# EAGLE design BpodFSM_2Plus_r1_3 (EAGLE 9.6.2)
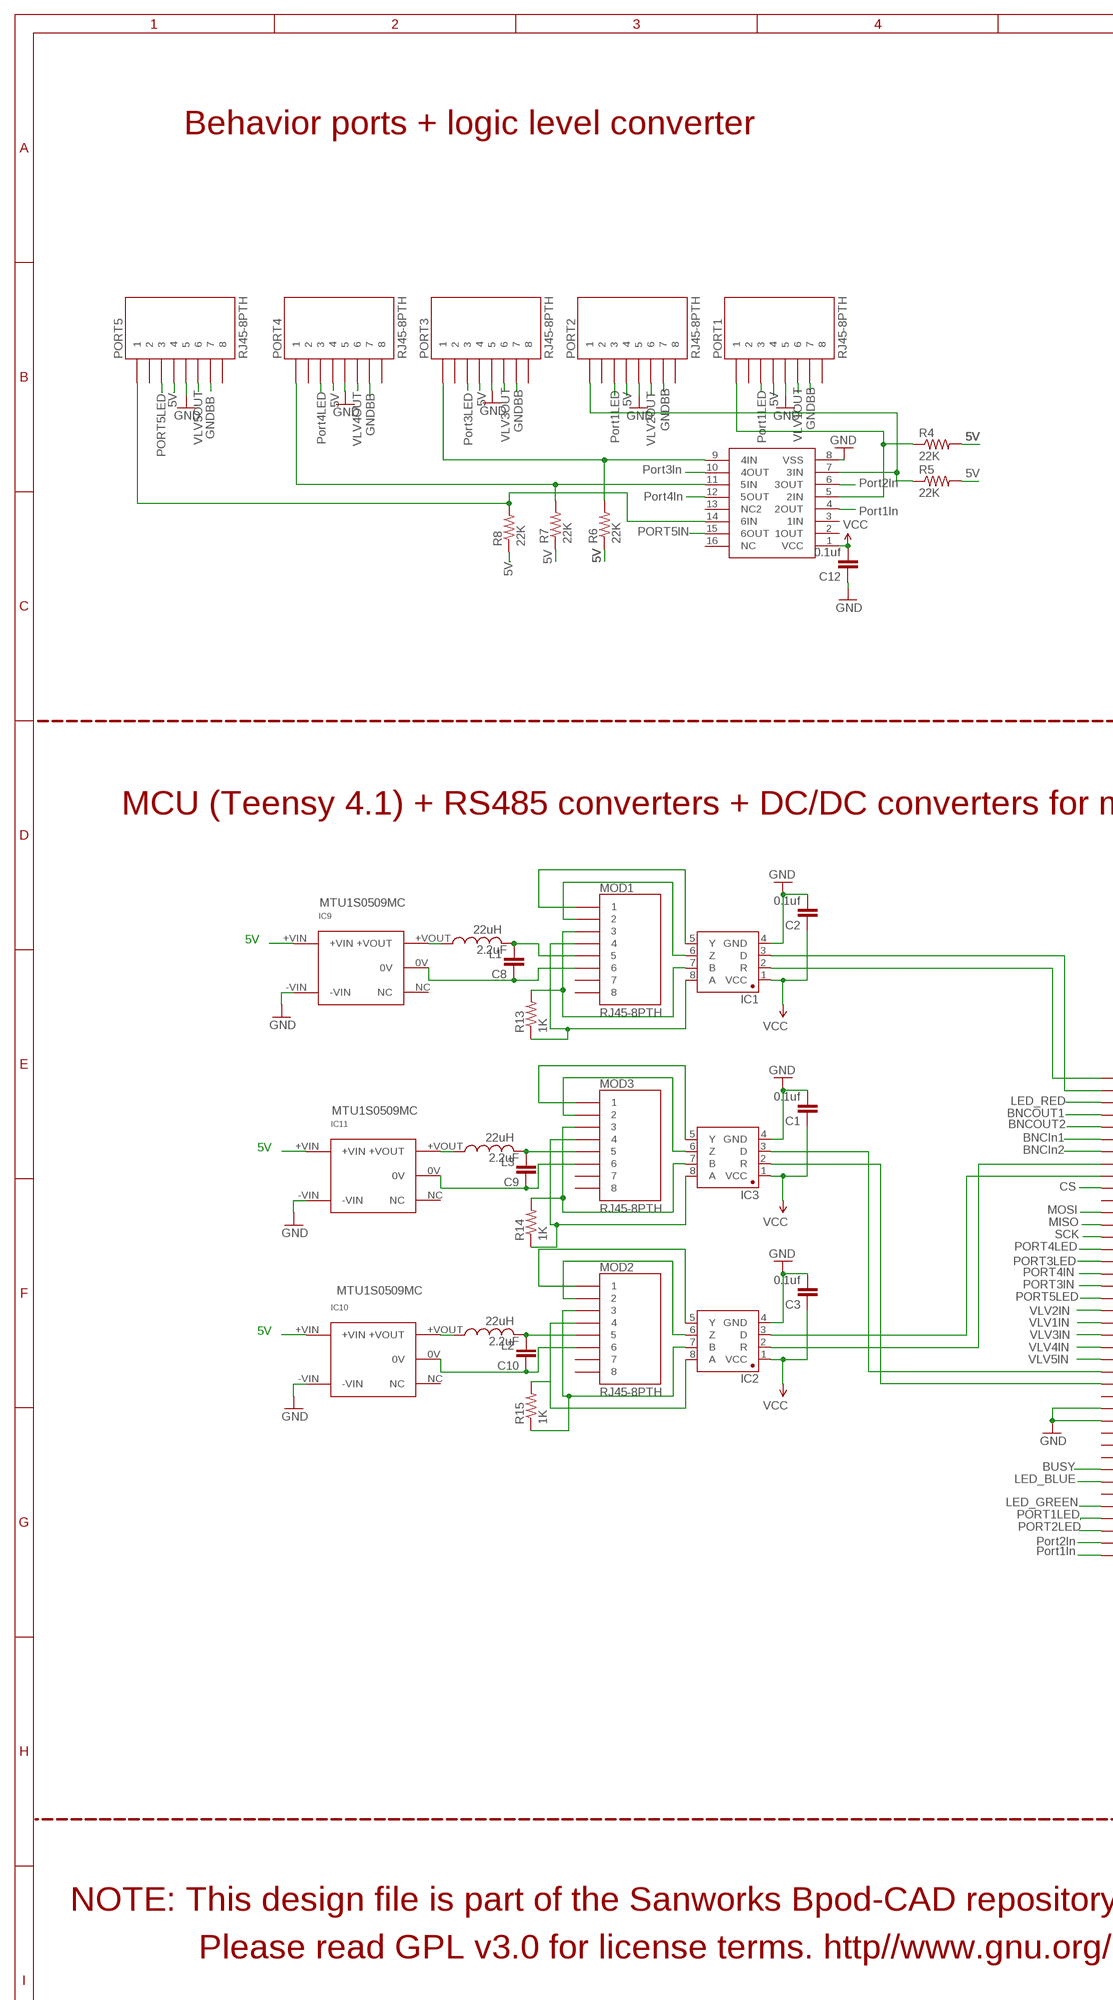
[diagram p0: schematic, sheet 1, part 1 of 2]
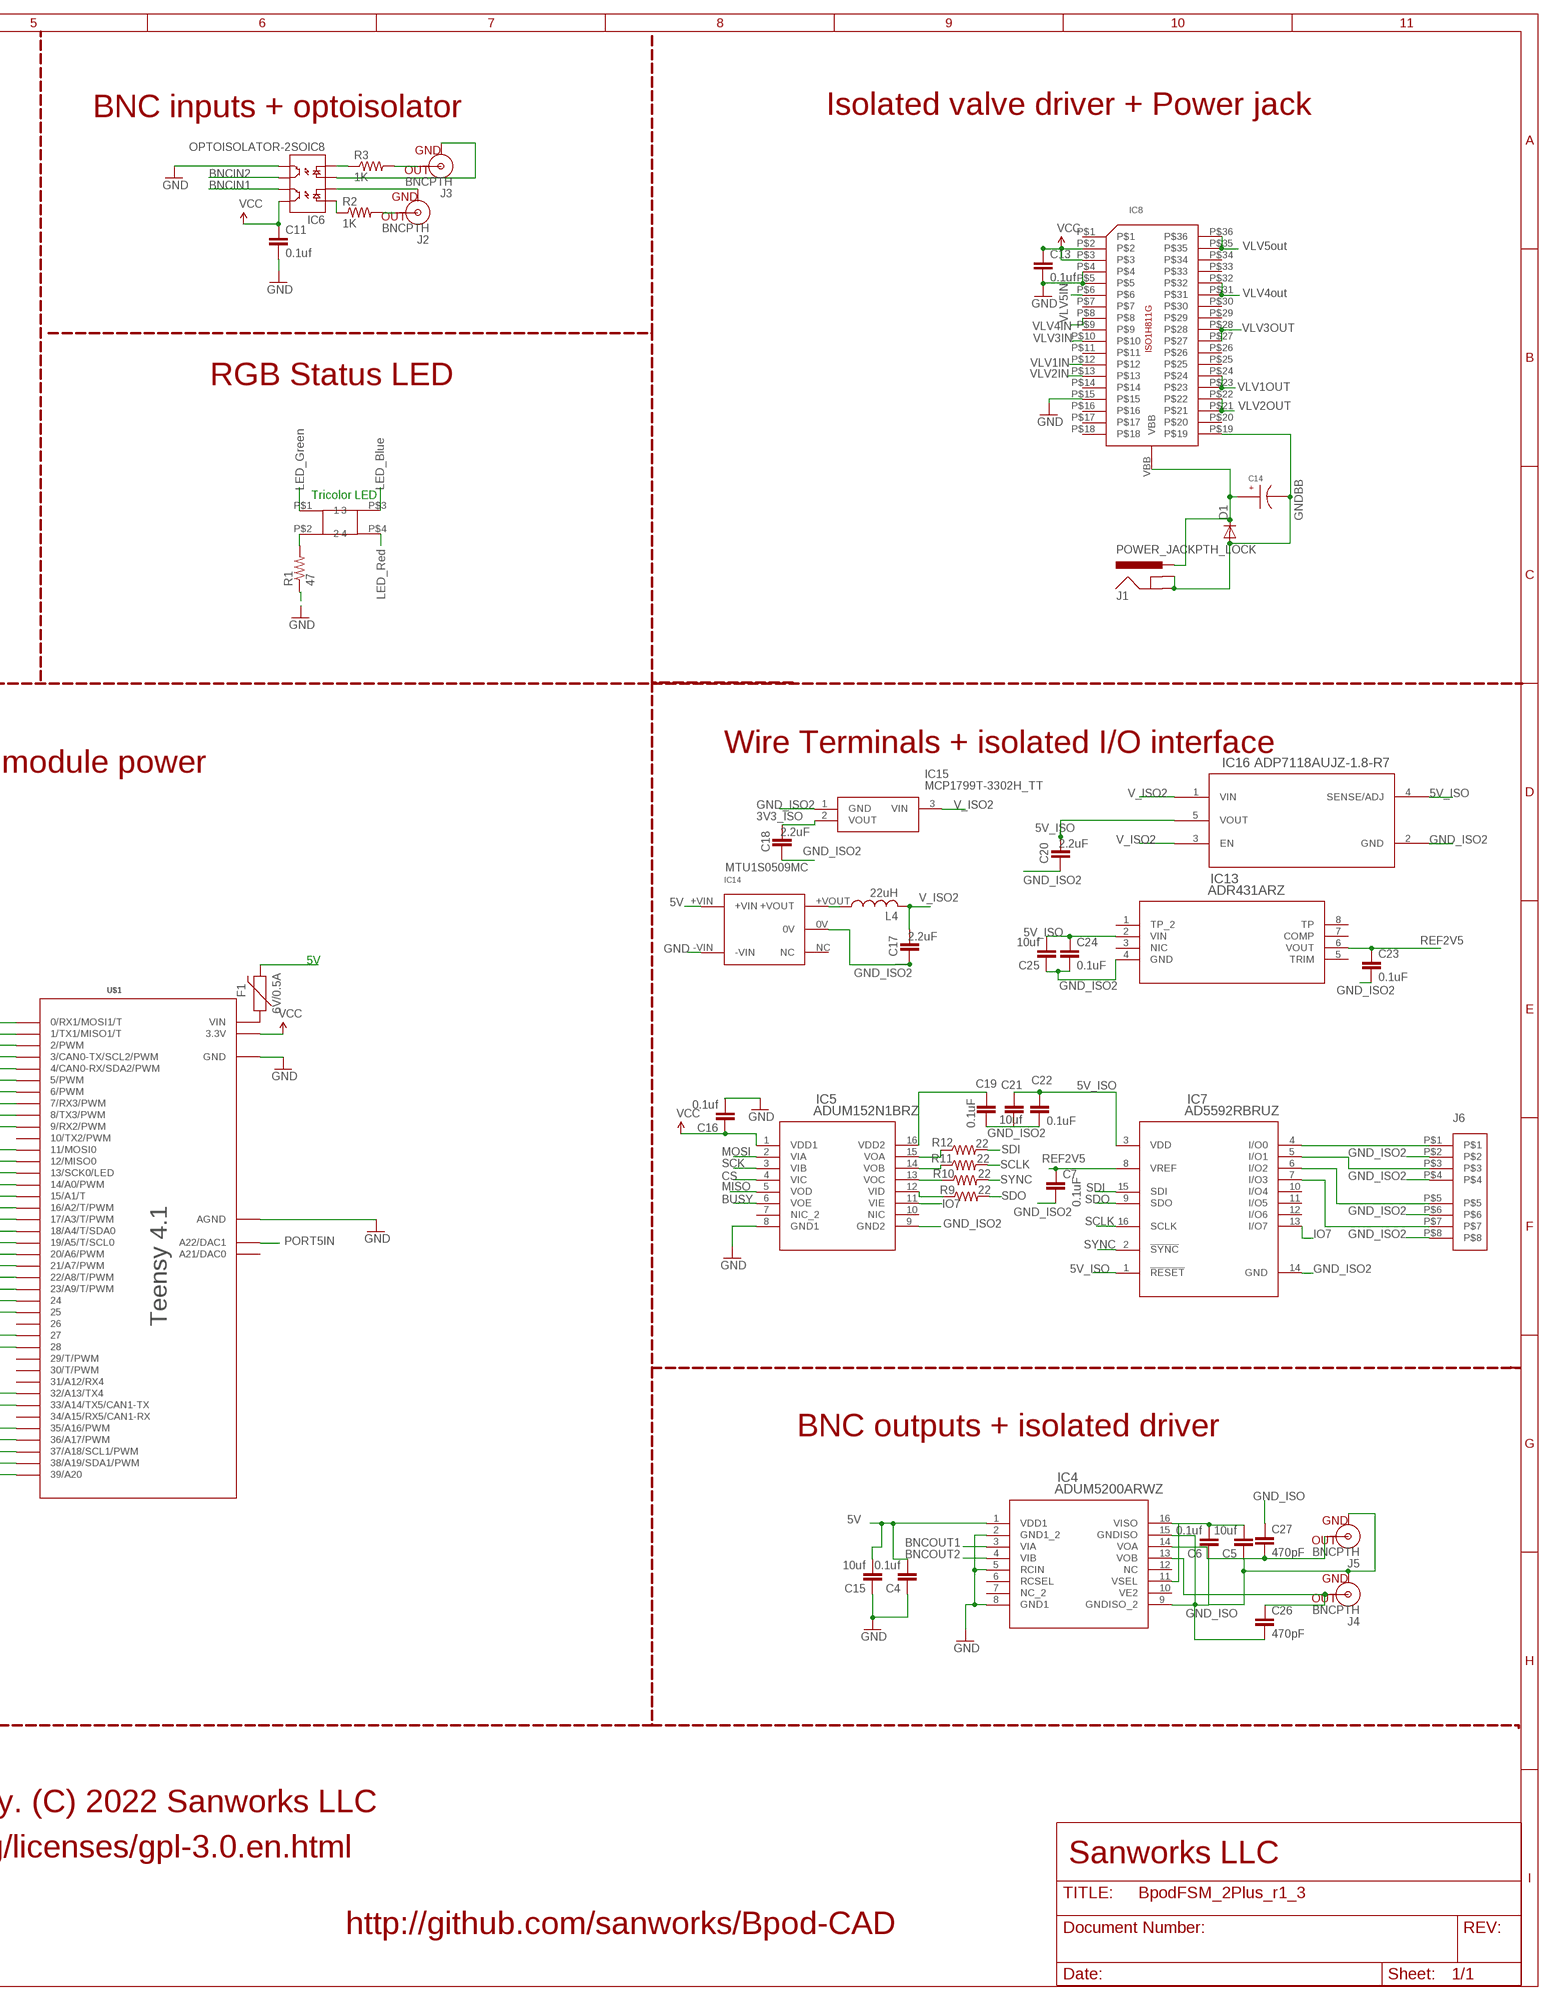
[diagram p1: schematic, sheet 1, part 2 of 2]

## Parts
C1  0.1uf  1.0UF-0805-25V-10%  [0805]
C2  0.1uf  1.0UF-0805-25V-10%  [0805]
C3  0.1uf  1.0UF-0805-25V-10%  [0805]
C4  0.1uf  1.0UF-0805-25V-10%  [0805]
C5  10uf  CAP1206  [1206@1]
C6  0.1uf  1.0UF-0805-25V-10%  [0805]
C7  0.1uF  1.0UF-0805-25V-10%  [0805]
C8  2.2uF  1.0UF-0805-25V-(+80/-20%)  [0805]
C9  2.2uF  1.0UF-0805-25V-(+80/-20%)  [0805]
C10  2.2uF  1.0UF-0805-25V-(+80/-20%)  [0805]
C11  0.1uf  1.0UF-0805-25V-10%  [0805]
C12  0.1uf  1.0UF-0805-25V-10%  [0805]
C13  0.1uf  1.0UF-0805-25V-10%  [0805]
C14  EEE-FK1H100UR  [EEE-FK1H100UR]
C15  10uf  CAP1206  [1206@1]
C16  0.1uf  1.0UF-0805-25V-10%  [0805]
C17  2.2uF  1.0UF-0805-25V-(+80/-20%)  [0805]
C18  2.2uF  1.0UF-0805-25V-(+80/-20%)  [0805]
C19  0.1uF  1.0UF-0805-25V-10%  [0805]
C20  2.2uF  1.0UF-0805-25V-(+80/-20%)  [0805]
C21  10uf  CAP1206  [1206@1]
C22  0.1uF  1.0UF-0805-25V-10%  [0805]
C23  0.1uF  1.0UF-0805-25V-10%  [0805]
C24  0.1uF  1.0UF-0805-25V-10%  [0805]
C25  10uf  CAP1206  [1206@1]
C26  470pF  1.0UF-0805-25V-10%  [0805]
C27  470pF  1.0UF-0805-25V-10%  [0805]
D1  DIODE-DO214AA  [DO214AA]
F1  6V/0.5A  PPTC_HALF-AMP  [1206]
IC1  SN65HVD31DR  [SO08]
IC2  SN65HVD31DR  [SO08]
IC3  SN65HVD31DR  [SO08]
IC4  ADUM5200ARWZ  [RW_16]
IC5  ADUM152N1BRZ  [R-16_ADI]
IC6  OPTOISOLATOR-2SOIC8  [SO08-2]
IC7  AD5592RBRUZ  [RU_16_ADI]
IC8  ISO1H811G  [ISO1H811G]
IC9  9V  MTU1D0505MC  [MTU1D0505MC]
IC10  9V  MTU1D0505MC  [MTU1D0505MC]
IC11  9V  MTU1D0505MC  [MTU1D0505MC]
IC12  CD4050  [SO16]
IC13  ADR431ARZ  [R_8_ADI]
IC14  5V  MTU1D0505MC  [MTU1D0505MC]
IC15  MCP1799T-3302H_TT  [SOT95P237X112-3N]
IC16  ADP7118AUJZ-1.8-R7  [UJ_5]
J1  POWER_JACKPTH_LOCK  [POWER_JACK_PTH_LOCK]
J2  BNCPTH  [BNC]
J3  BNCPTH  [BNC]
J4  BNCPTH  [BNC]
J5  BNCPTH  [BNC]
J6  8POS_MOLEX_SOCKET  [8POS_MOLEX_SOCKET]
L1  22uH  L-USL3225M  [L3225M]
L2  22uH  L-USL3225M  [L3225M]
L3  22uH  L-USL3225M  [L3225M]
L4  22uH  L-USL3225M  [L3225M]
MOD1  RJ45-8PTH  [RJ45-8]
MOD2  RJ45-8PTH  [RJ45-8]
MOD3  RJ45-8PTH  [RJ45-8]
PORT1  RJ45-8PTH  [RJ45-8]
PORT2  RJ45-8PTH  [RJ45-8]
PORT3  RJ45-8PTH  [RJ45-8]
PORT4  RJ45-8PTH  [RJ45-8]
PORT5  RJ45-8PTH  [RJ45-8]
R1  47  RESISTOR1206  [1206]
R2  1K  RESISTOR1206  [1206]
R3  1K  RESISTOR1206  [1206]
R4  22K  RESISTOR1206  [1206]
R5  22K  RESISTOR1206  [1206]
R6  22K  RESISTOR1206  [1206]
R7  22K  RESISTOR1206  [1206]
R8  22K  RESISTOR1206  [1206]
R9  22  R-US_R0805  [R0805]
R10  22  R-US_R0805  [R0805]
R11  22  R-US_R0805  [R0805]
R12  22  R-US_R0805  [R0805]
R13  1K  RESISTOR1206  [1206]
R14  1K  RESISTOR1206  [1206]
R15  1K  RESISTOR1206  [1206]
U$1  TEENSY_3.6_DIL  [TEENSY_3.6_DIL]
U$8  SQUARE_TRICOLOR_LED  [SQUARE_TRICOLOR_LED]

## Nets
3V3_ISO: C18.2 C19.1 IC5.16(VDD2) IC15.2(VOUT)
5V: C4.2 C15.2 F1.2 IC4.1(VDD1) IC9.+VIN IC10.+VIN IC11.+VIN IC14.+VIN PORT1.4 PORT2.4 PORT3.4 PORT4.4 PORT5.4 R4.2 R5.2 R6.1 R7.1 R8.1
5V_ISO: C20.2 C21.2 C22.1 C24.1 C25.2 IC7.1(!RESET) IC7.3(VDD) IC13.2(VIN) IC16.4(SENSE/ADJ) IC16.5(VOUT)
BNCIN1: IC6.7(EM1) U$1.6(6/PWM)
BNCIN2: IC6.6(CL2) U$1.5(5/PWM)
BNCOUT1: IC4.3(VIA) U$1.3(3/CAN0-TX/SCL2/PWM)
BNCOUT2: IC4.4(VIB) U$1.4(4/CAN0-RX/SDA2/PWM)
BUSY: IC5.6(VOE) U$1.32/A13(32/A13/TX4)
CS: IC5.4(VIC) U$1.9(9/RX2/PWM)
GND: C1.2 C2.2 C3.2 C4.1 C11.2 C12.1 C13.2 C15.1 C16.2 IC1.4(GND) IC2.4(GND) IC3.4(GND) IC4.2(GND1_2) IC4.5(RCIN) IC4.8(GND1) IC5.8(GND1) IC6.5(EM2) IC8.P$4 IC8.P$5 IC8.P$15 IC9.-VIN IC10.-VIN IC11.-VIN IC12.8(VSS) IC14.-VIN PORT1.5 PORT2.5 PORT3.5 PORT4.5 PORT5.5 R1.1 U$1.27 U$1.28 U$1.AGND U$1.GND U$1.GND1(GND)
GND_ISO: C5.1 C6.1 C26.2 C27.1 IC4.9(GNDISO_2) IC4.15(GNDISO) J4.GND J5.GND
GND_ISO2: C7.2 C17.1 C18.1 C19.2 C20.1 C21.1 C22.2 C23.2 C24.2 C25.1 IC5.9(GND2) IC7.14(GND) IC13.4(GND) IC14.0V IC15.1(GND) IC16.2(GND) J6.P$2 J6.P$4 J6.P$6 J6.P$8
GNDBB: C14.CATHODE D1.A IC8.P$19 J1.GND J1.GNDBREAK PORT1.7 PORT2.7 PORT3.7 PORT4.7 PORT5.7
IO7: IC5.11(VIE) IC7.13(I/O7)
LED_BLUE: U$1.33/A14(33/A14/TX5/CAN1-TX) U$8.P$3
LED_GREEN: U$1.35/A16(35/A16/PWM) U$8.P$1
LED_RED: U$1.2(2/PWM) U$8.P$4
MISO: IC5.5(VOD) U$1.12(12/MISO0)
MOSI: IC5.2(VIA) U$1.11(11/MOSI0)
N$1: IC3.8(A) MOD3.4 R14.1
N$2: IC3.7(B) MOD3.3 R14.2
N$3: IC3.6(Z) MOD3.2
N$4: IC3.5(Y) MOD3.1
N$5: IC3.2(R) U$1.25
N$6: IC3.3(D) U$1.24
N$7: IC1.8(A) MOD1.4 R13.1
N$8: IC1.7(B) MOD1.3 R13.2
N$9: IC1.6(Z) MOD1.2
N$10: IC1.5(Y) MOD1.1
N$11: IC1.2(R) U$1.0(0/RX1/MOSI1/T)
N$12: IC1.3(D) U$1.1(1/TX1/MISO1/T)
N$13: IC6.3(A2) J3.GND
N$14: J3.S(OUT) R3.2
N$15: J2.S(OUT) R2.2
N$16: IC6.2(C1) J2.GND
N$17: IC2.8(A) MOD2.4 R15.2
N$18: IC2.7(B) MOD2.3 R15.1
N$19: IC2.6(Z) MOD2.2
N$20: IC12.7(3IN) PORT2.1 R5.1
N$21: IC2.5(Y) MOD2.1
N$22: IC2.2(R) U$1.7(7/RX3/PWM)
N$23: C8.2 L1.2 MOD1.5
N$24: IC12.9(4IN) PORT3.1 R6.2
N$25: R1.2 U$8.P$2
N$26: C8.1 IC9.0V MOD1.6
N$27: C5.2 C6.2 IC4.11(VSEL) IC4.16(VISO)
N$28: IC2.3(D) U$1.8(8/TX3/PWM)
N$29: F1.1 U$1.VIN
N$30: IC7.4(I/O0) J6.P$1
N$31: IC12.11(5IN) PORT4.1 R7.2
N$32: C27.2 IC4.14(VOA) J5.S(OUT)
N$33: C26.1 IC4.13(VOB) J4.S(OUT)
N$34: IC7.5(I/O1) J6.P$3
N$35: IC7.6(I/O2) J6.P$5
N$36: IC7.7(I/O3) J6.P$7
N$37: IC14.+VOUT L4.1
N$38: IC5.15(VOA) R12.1
N$39: IC9.+VOUT L1.1
N$40: IC5.14(VOB) R11.1
N$41: IC12.14(6IN) PORT5.1 R8.2
N$42: IC5.13(VOC) R10.1
N$43: C10.1 IC10.0V MOD2.6
N$44: C10.2 L2.2 MOD2.5
N$45: IC10.+VOUT L2.1
N$46: IC5.12(VID) R9.1
N$47: C9.1 IC11.0V MOD3.6
N$49: C9.2 L3.2 MOD3.5
N$50: IC11.+VOUT L3.1
N$54: IC6.1(A1) R2.1
N$55: IC6.4(C2) R3.1
N$56: IC12.5(2IN) PORT1.1 R4.1
PORT1IN: IC12.4(2OUT) U$1.39/A20
PORT1LED: PORT1.3 U$1.36/A17(36/A17/PWM)
PORT2IN: IC12.6(3OUT) U$1.38/A19(38/A19/SDA1/PWM)
PORT2LED: PORT2.3 U$1.37/A18(37/A18/SCL1/PWM)
PORT3IN: IC12.10(4OUT) U$1.17/A3(17/A3/T/PWM)
PORT3LED: PORT3.3 U$1.15/A1(15/A1/T)
PORT4IN: IC12.12(5OUT) U$1.16/A2(16/A2/T/PWM)
PORT4LED: PORT4.3 U$1.14/A0(14/A0/PWM)
PORT5IN: IC12.15(6OUT) U$1.A22(A22/DAC1)
PORT5LED: PORT5.3 U$1.18/A4(18/A4/T/SDA0)
REF2V5: C7.1 C23.1 IC7.8(VREF) IC13.6(VOUT)
SCK: IC5.3(VIB) U$1.13(13/SCK0/LED)
SCLK: IC7.16(SCLK) R11.2
SDI: IC7.15(SDI) R12.2
SDO: IC7.9(SDO) R9.2
SYNC: IC7.2(!SYNC) R10.2
V_ISO2: C17.2 IC15.3(VIN) IC16.1(VIN) IC16.3(EN) L4.2
VBB: C14.ANODE D1.C IC8.VBB J1.PWR
VCC: C1.1 C2.1 C3.1 C11.1 C12.2 C13.1 C16.1 IC1.1(VCC) IC2.1(VCC) IC3.1(VCC) IC5.1(VDD1) IC6.8(CL1) IC8.P$2 IC8.P$3 IC12.1(VCC) U$1.3.3V U$1.3.3V3(3.3V)
VLV1IN: IC8.P$12 U$1.20/A6(20/A6/PWM)
VLV1OUT: IC8.P$23 IC8.P$24 PORT1.6
VLV2IN: IC8.P$13 U$1.19/A5(19/A5/T/SCL0)
VLV2OUT: IC8.P$21 IC8.P$22 PORT2.6
VLV3IN: IC8.P$10 U$1.21/A7(21/A7/PWM)
VLV3OUT: IC8.P$27 IC8.P$28 PORT3.6
VLV4IN: IC8.P$8 U$1.22/A8(22/A8/T/PWM)
VLV4OUT: IC8.P$31 IC8.P$32 PORT4.6
VLV5IN: IC8.P$6 U$1.23/A9(23/A9/T/PWM)
VLV5OUT: IC8.P$35 IC8.P$36 PORT5.6
Unconnected: IC4.6(RCSEL) IC4.7(NC_2) IC4.10(VE2) IC4.12(NC) IC5.7(NIC_2) IC5.10(NIC) IC7.10(I/O4) IC7.11(I/O5) IC7.12(I/O6) IC8.P$1 IC8.P$7 IC8.P$9 IC8.P$11 IC8.P$14 IC8.P$16 IC8.P$17 IC8.P$18 IC8.P$20 IC8.P$25 IC8.P$26 IC8.P$29 IC8.P$30 IC8.P$33 IC8.P$34 IC9.NC IC10.NC IC11.NC IC12.2(1OUT) IC12.3(1IN) IC12.13(NC2) IC12.16(NC) IC13.1(TP_2) IC13.3(NIC) IC13.5(TRIM) IC13.7(COMP) IC13.8(TP) IC14.NC MOD1.7 MOD1.8 MOD2.7 MOD2.8 MOD3.7 MOD3.8 PORT1.2 PORT1.8 PORT2.2 PORT2.8 PORT3.2 PORT3.8 PORT4.2 PORT4.8 PORT5.2 PORT5.8 U$1.10(10/TX2/PWM) U$1.26 U$1.29(29/T/PWM) U$1.30(30/T/PWM) U$1.31/A12(31/A12/RX4) U$1.34/A15(34/A15/RX5/CAN1-RX) U$1.A21(A21/DAC0)

## Notes on the sheet
- BNC inputs + optoisolator | Isolated valve driver + Power jack
- Behavior ports + logic level converter
- BNCIN2
- BNCIN1
- VLV5out
- VLV4out
- 5V | 5V | 5V | 5V | RGB Status LED
- GNDBB | GNDBB | GNDBB
- GNDBB
- Port1LED | Port1LED | 5V
- Port4LED | Port3LED
- LED_Green
- LED_Blue
- Port3In
- 5V
- Port2In
- Port4In
- GNDBB
- Port1In
- Tricolor LED
- 5V | 5V
- LED_Red
- Wire Terminals + isolated I/O interface
- MCU (Teensy 4.1) + RS485 converters + DC/DC converters for module power
- MTU1S0509MC
- MTU1S0509MC
- 5V
- 5V
- MTU1S0509MC
- BNCIn1
- 5V | BNCIn2
- MTU1S0509MC
- 5V
- Teensy 4.1
- BNC outputs + isolated driver
- Port2In
- Port1In
- NOTE: This design file is part of the Sanworks Bpod-CAD repository. (C) 2022 Sanworks LLC
- Please read GPL v3.0 for license terms. http//www.gnu.org/licenses/gpl-3.0.en.html | Sanworks LLC
- http://github.com/sanworks/Bpod-CAD

## Library data of the parts
C1-C4 C6 C7 C11-C13 C16 C19 C22-C24 C26 C27 = SparkFun-Capacitors:1.0UF: 1µF ceramic capacitors A capacitor is a passive two-terminal electrical component used to store electrical energy temporarily in an electric field.; PROD_ID: CAP-08064; VALUE: 1.0uF
C5 C15 C21 C25 = SparkFun-Capacitors:CAP: Capacitor Standard 0603 ceramic capacitor, and 0.1" leaded capacitor.
C8-C10 C17 C18 C20 = SparkFun-Capacitors:1.0UF: 1µF ceramic capacitors A capacitor is a passive two-terminal electrical component used to store electrical energy temporarily in an electric field.; PROD_ID: CAP-11625; VALUE: 1.0uF
C14 = JoshParts10:EEE-FK1H100UR
D1 = diode:DIODE-: DIODE
F1 = SparkFun-Fuses:PPTC: Resettable Fuse PPTC Resettable Fuse. Really a sort of resistor with a polymeric positive temperature coefficient whose resistance increases dramatically with an increase in temperature. When heated by the power passing through the resistance rises causing the current to be limited, protecting the circuit. This is achieved by the transition of the polymer from a crystalline to an amorphous state where the conductive carbon separates breaking the conductive pathways found in the cool crystalline structure. When a PPTC cools back down it resumes conducting letting the circuit turn back on. SparkFun Products: SparkFun RedBoard - Programmed with Arduino <https://www.sparkfun.com/products/12757> Pro Micro - 5V/16MHz <https://www.sparkfun.com/products/12640> Arduino Pro 328 - 5V/16MHz <https://www.sparkfun.com/products/10915> MP3 Trigger <https://www.sparkfun.com/products/13720>; PROD_ID: RES-08585
IC1-IC3 = Joshparts4:SN65HVD31DR: A placeholder for generic narrow & wide SOIC8 foorptints - used on the DIP adapter board.
IC4 = ADUM5200:ADUM5200ARWZ
IC5 = ADUM152N:ADUM152N1BRZ; BUILT_BY: EMA_Cory; COPYRIGHT: Copyright (C) 2018 Accelerated Designs. All rights reserved; DATASHEET: https://www.analog.com/media/en/technical-documentation/data-sheets/ADuM150N-151N-152N.pdf; MANUFACTURER_PART_NUMBER: ADUM152N1BRZ; SOURCELIBRARY: Analog_Devices_Inc_2020-09-08; VENDOR: Analog Devices Inc
IC6 = SparkFun-DiscreteSemi:OPTOISOLATOR-2: Description: Dual gate opto isolator. Vishay part : ILD213T; PROD_ID: IC-09076
IC7 = AD5592RBRUZ:AD5592RBRUZ; BUILT_BY: EMA_UL_Team; MANUFACTURER_PART_NUMBER: AD5592RBRUZ; SOURCELIBRARY: Analog_2015-12-15; VENDOR: Analog Devices Inc
IC8 = JoshParts10:ISO1H811G
IC9-IC11 IC14 = JoshParts10:MTU1D0505MC
IC12 = SparkFun-DigitalIC:CD4050
IC13 = ADR431:ADR431ARZ; BUILT_BY: EMA_UL_Team; MANUFACTURER_PART_NUMBER: ADR431ARZ; SOURCELIBRARY: Analog_2015-01-06; VENDOR: Analog Devices Inc
IC15 = MCP1799T-3302H_TT:MCP1799T-3302H_TT: MICROCHIP - MCP1799T-3302H/TT - LDO, FIXED, 3.3V, 0.08A, -40 TO 150DEG C Source: Datasheet <https://ms.componentsearchengine.com/Datasheets/1/MCP1799T-3302H_TT.pdf>; DESCRIPTION: MICROCHIP - MCP1799T-3302H/TT - LDO, FIXED, 3.3V, 0.08A, -40 TO 150DEG C; HEIGHT: 1.12mm; MANUFACTURER_NAME: Microchip; MANUFACTURER_PART_NUMBER: MCP1799T-3302H/TT; MOUSER_PART_NUMBER: 579-CP1799T-3302H/TT; MOUSER_PRICE-STOCK: https://www.mouser.co.uk/ProductDetail/Microchip-Technology-Atmel/MCP1799T-3302H-TT?qs=BJlw7L4Cy78EAGTR6Iuibw%3D%3D
IC16 = ADP7118:ADP7118AUJZ-1.8-R7
J1 = SparkFun-Connectors:POWER_JACK: Power Jack Connector This is the standard 5.5mm barrel jack for power. The PTH is the most common, proven, reliable, footprint. The Slot footprint only works if the mill layer is transmitted to the PCB fab house so be warned. Here are the connectors we sell at SparkFun: DC Barrel Power Jack/Connector <https://www.sparkfun.com/products/119> (PRT-00119) DC Barrel Power Jack/Connector (SMD) <https://www.sparkfun.com/products/12748> (PRT-12748) DC Barrel Jack Adapter - Breadboard Compatible <https://www.sparkfun.com/products/10811> (PRT-10811) It is used on this SparkFun product (and many, many others): SparkFun RedBoard - Programmed with Arduino <https://www.sparkfun.com/products/12757> (DEV-12757) Also, if you need a mating power supply or connector, please check these out: Wall Adapter Power Supply - 9VDC 650mA <https://www.sparkfun.com/products/298> (TOL-00298) DC Barrel Jack Adapter - Male <https://www.sparkfun.com/products/10287> (PRT-10287); PROD_ID: CONN-08197; SF_ID: PRT-00119
J2-J5 = SparkFun-Connectors:BNC: BNC Right Angle Connector Mouser Part# 5227161 SparkFun Products: BNC Connector - Right Angle <https://www.sparkfun.com/products/10550>; PROD_ID: LPA-12729; SF_ID: PRT-10550
J6 = JoshParts10:8POS_MOLEX_SOCKET
L1-L4 = rcl:L-US: INDUCTOR, American symbol
MOD1-MOD3 PORT1-PORT5 = SparkFun:RJ45-8: RJ45 Jack Simple RJ45, 8-pin connection - connector for common Cat5, Cat5e, and Cat6 Ethernet cables. Footprint not yet proven in production. Connector sku is PRT-00643; Breakout PCB sku is BOB-00716.
R1 = SparkFun-Passives:RESISTOR: Resistor Basic schematic elements and footprints for 0603, 1206, and PTH resistors.
R2-R8 R13-R15 = SparkFun-Resistors:RESISTOR: Resistor Basic schematic elements and footprints for 0603, 1206, and PTH resistors.
R9-R12 = adafruit:R-US_: RESISTOR, American symbol
U$1 = Teensy_3_and_LC_Series_Boards_v1.4:TEENSY_3.6_DIL: Teensy 3.6 DIL Package
U$8 = JoshParts:SQUARE_TRICOLOR_LED

## Net classes
0 default: width 0.254 mm, clearance 0.254 mm

## Board
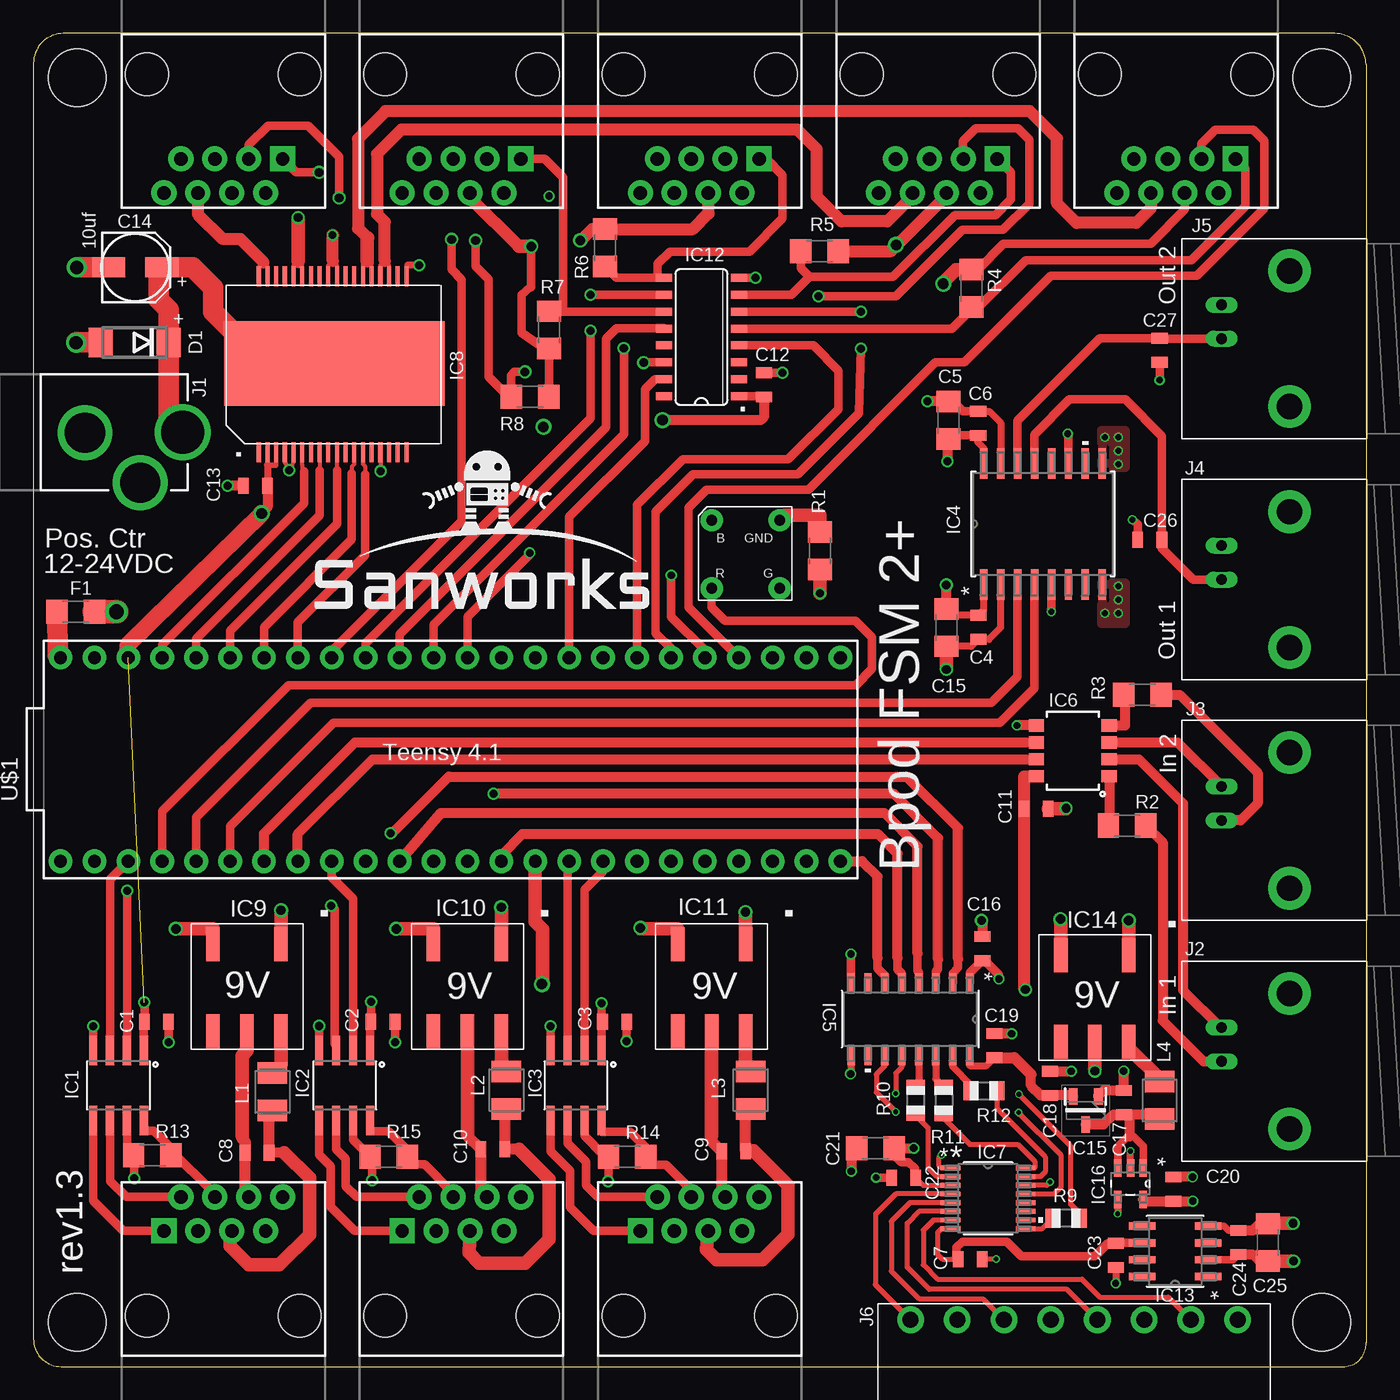
[diagram p2: board, top side]
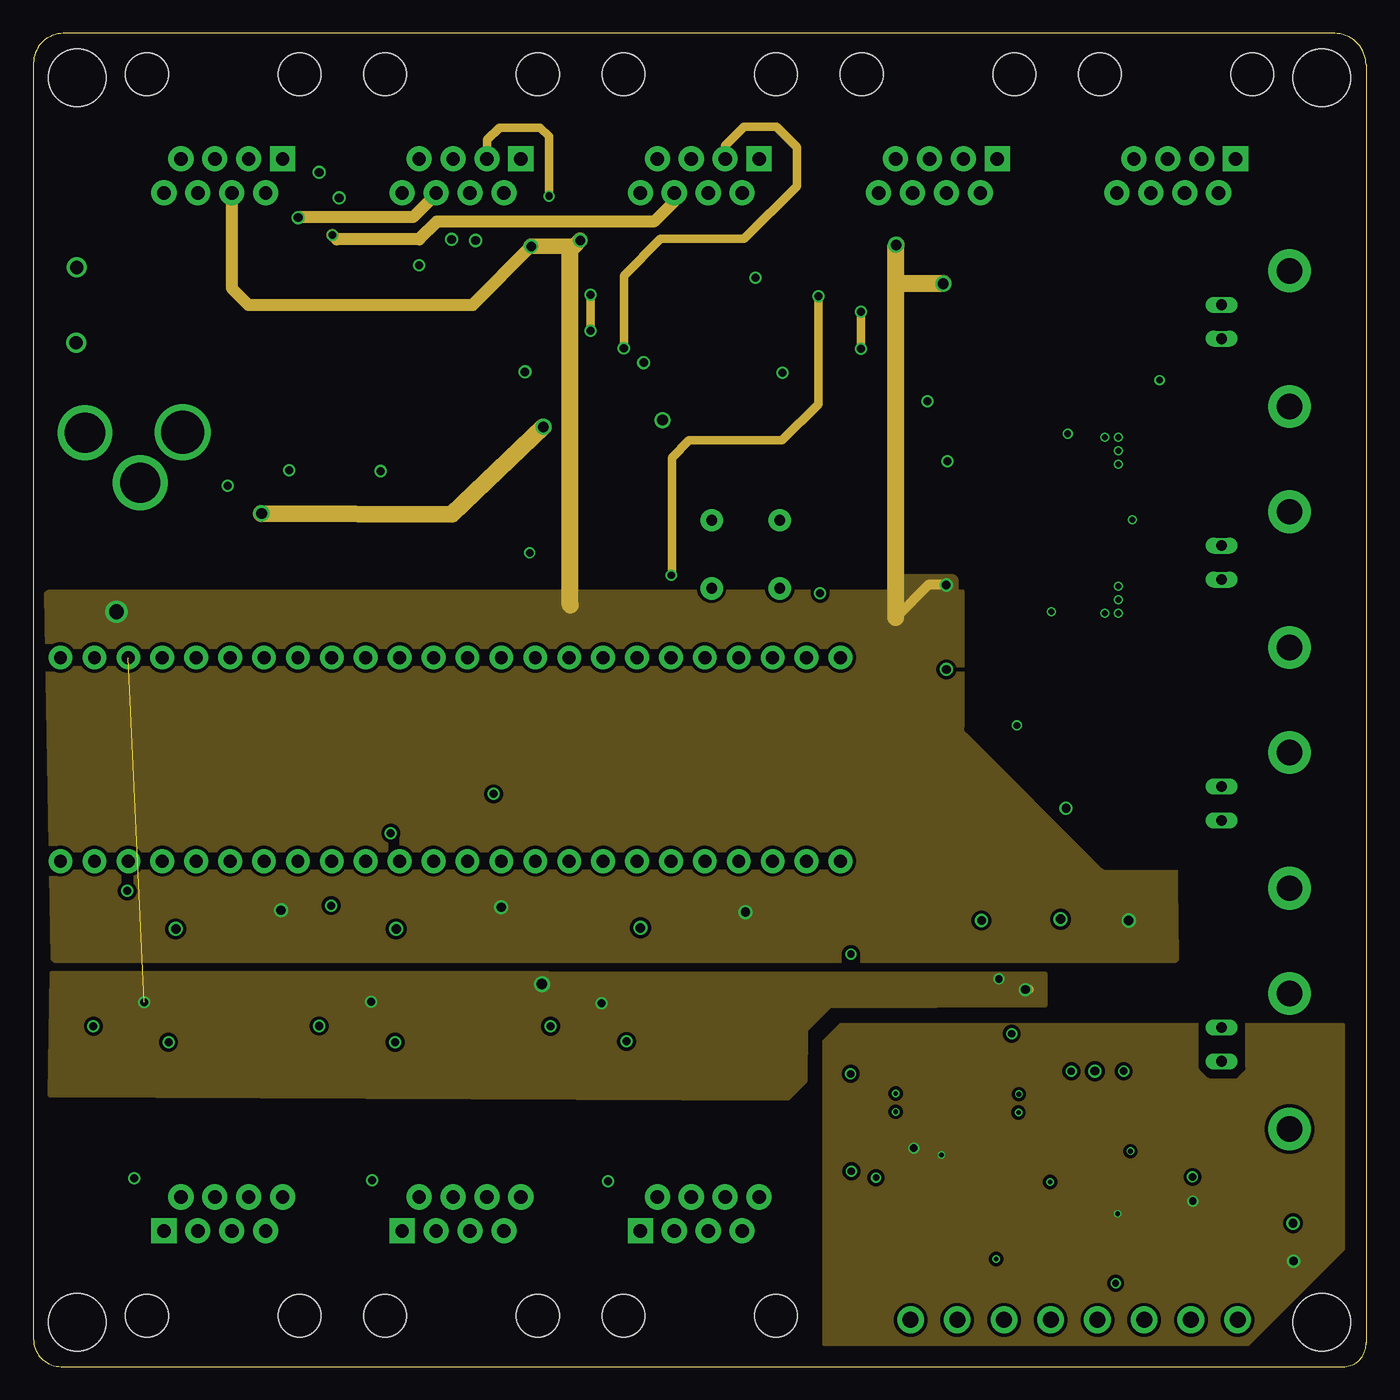
[diagram p3: board, inner layer Route2]
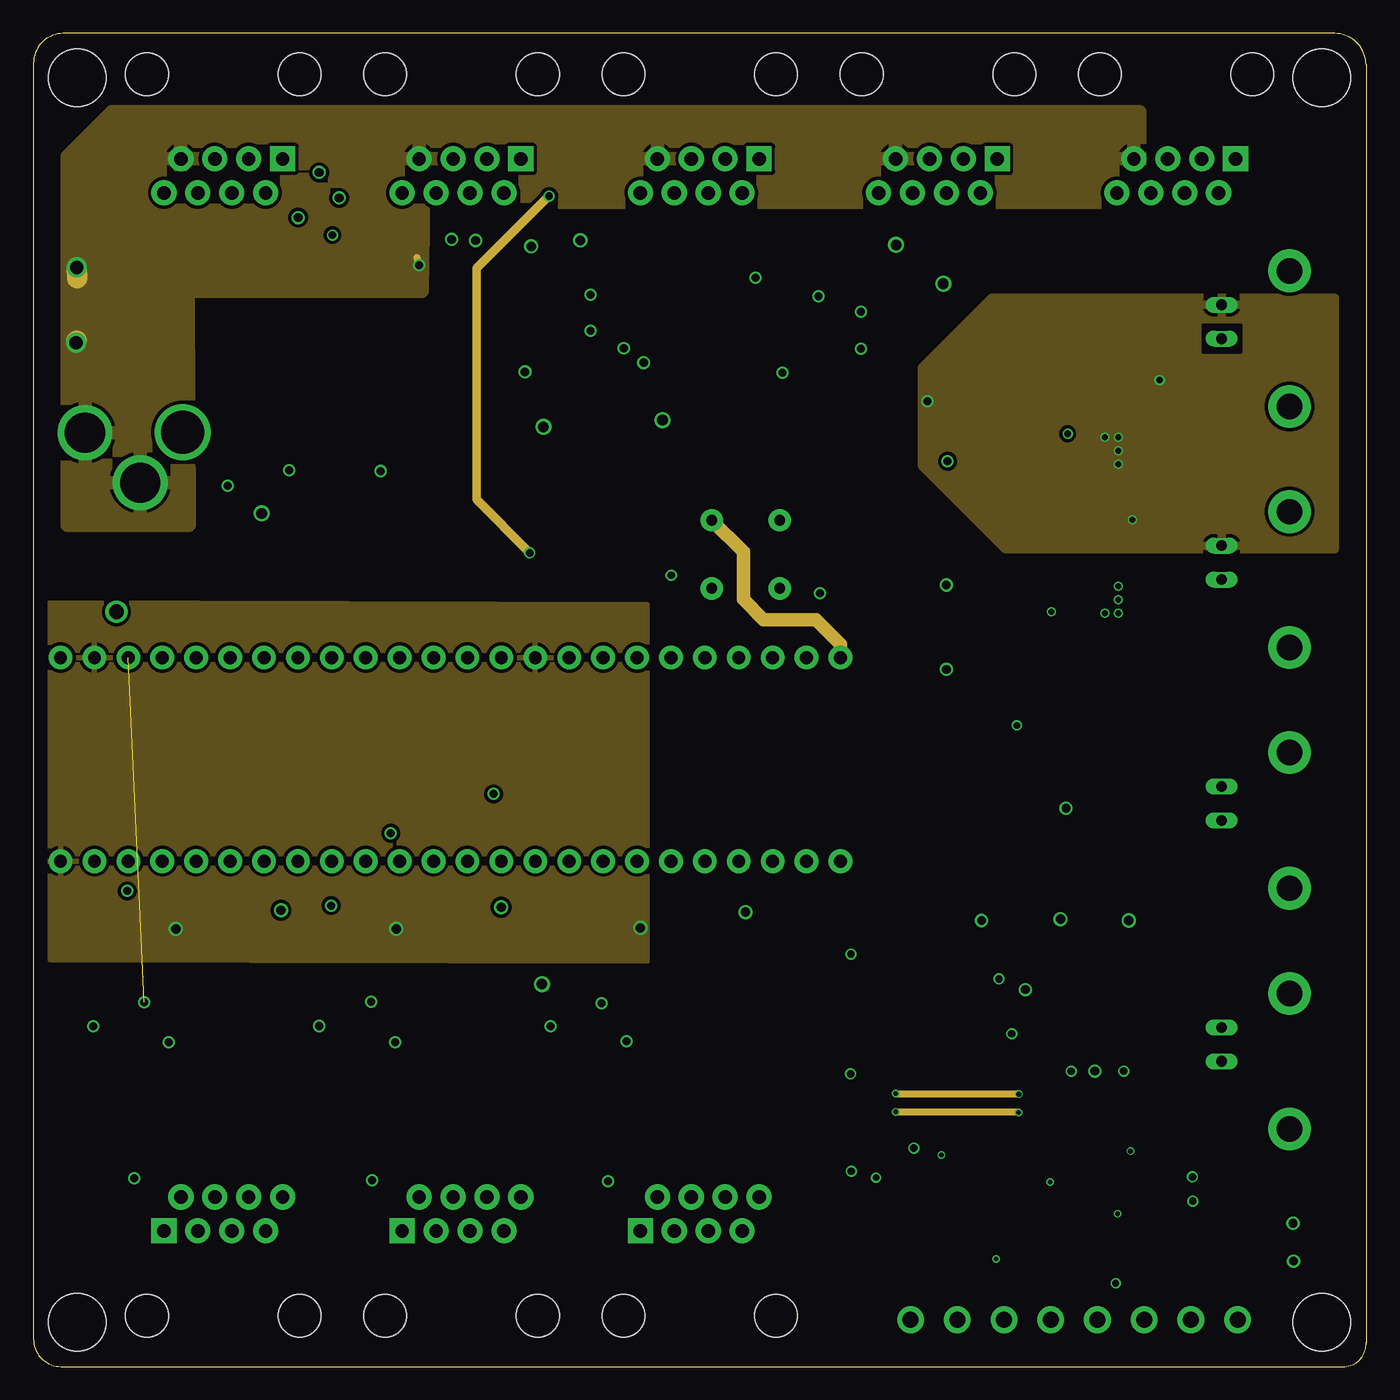
[diagram p4: board, inner layer Route15]
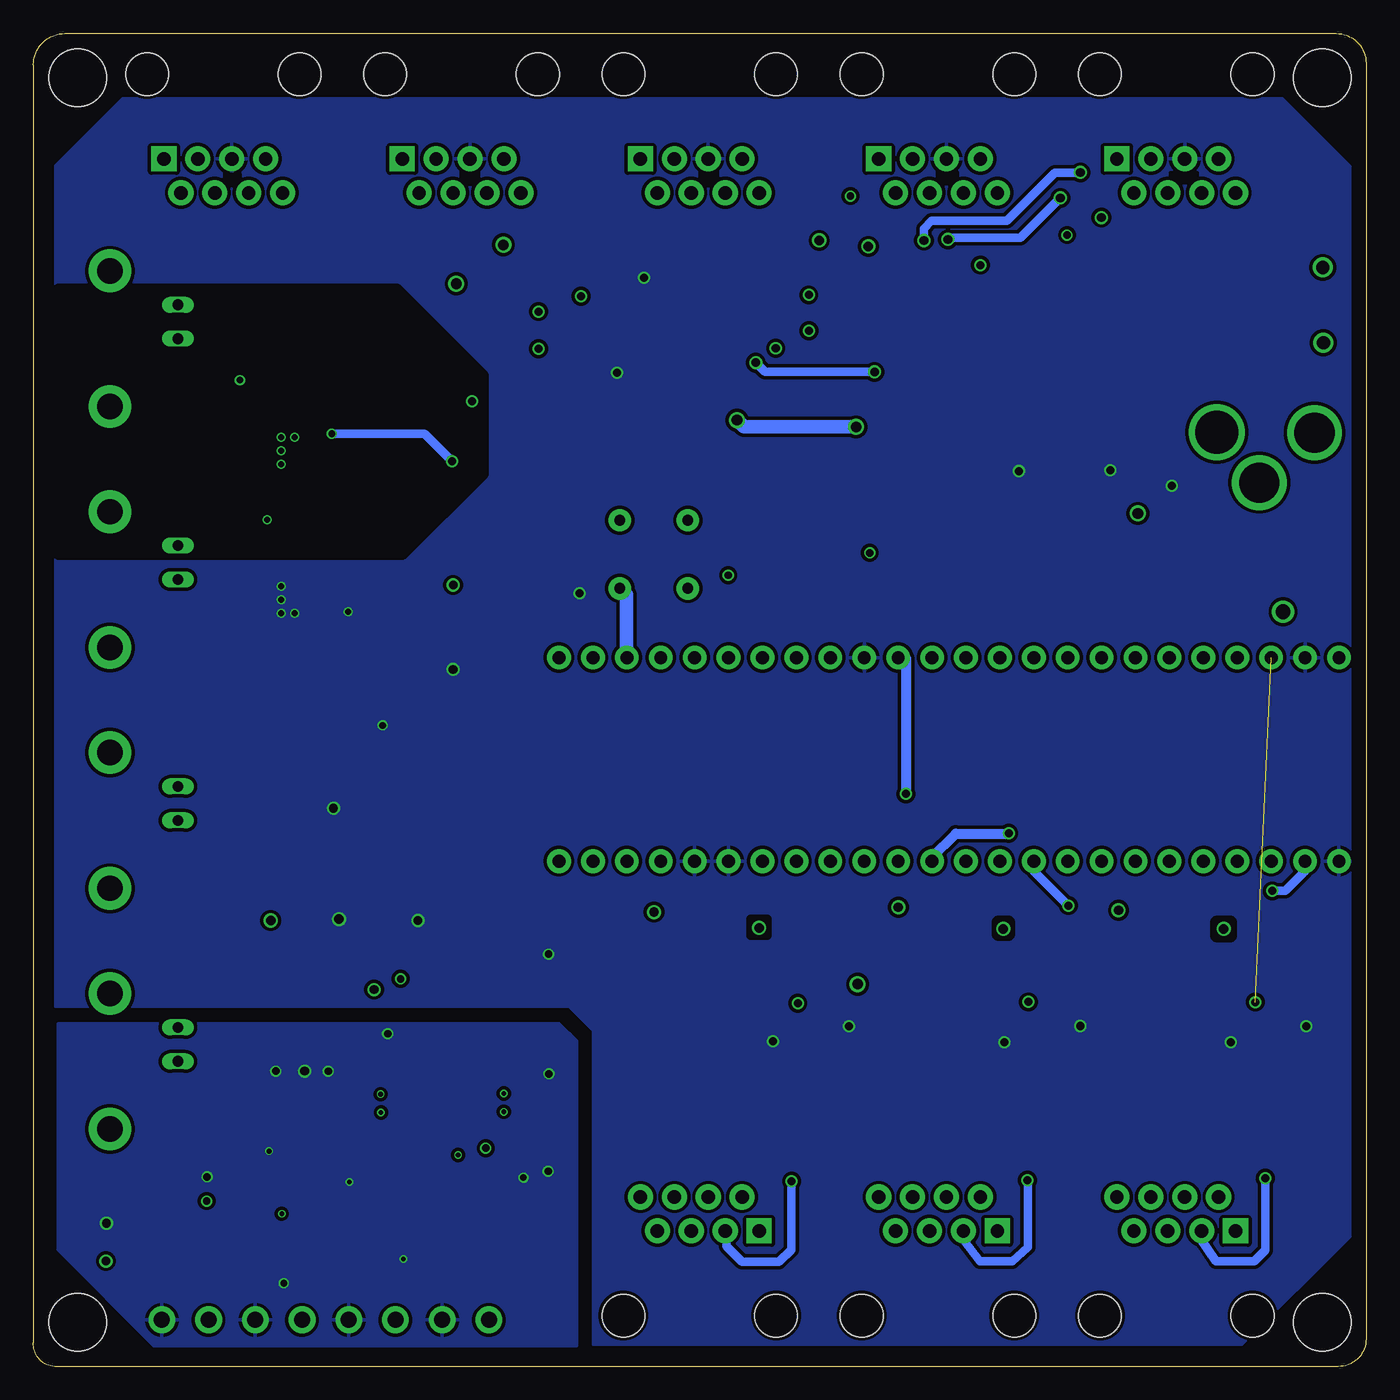
[diagram p5: board, bottom side, seen from below]

Size 99.82 x 99.82 mm. Coordinates in mm from the lower left corner, seen from the top.
Outline: 99.82,1.79 arc-90 98.21,0 2.08,0 arc-90 0,2.08 0,97.57 arc-90 2.25,99.82 97.46,99.82 arc-90 99.82,97.46 99.82,1.78
Copper layers (1*2*15*16): Top 0.035mm / dielectric 0.2mm / Route2 0.0175mm / dielectric 0.3mm / Route15 0.0175mm / dielectric 0.2mm / Bottom 0.035mm
Design rules "SeeedStudio_4layer_DRU_no_angle_20140221 *": minimum track width 8mil, minimum drill 12mil, track to track 8mil, track to pad 6mil, pad to pad 6mil, via to via 12mil, smd to smd 0mil, copper to edge 10mil, drill to drill 8mil, minimum pad ring 6mil, minimum via ring 4mil, stop-mask expansion 4mil, vias tented up to drill 25mil, thermal gap 10mil
Holes 4.32 mm at 3.3,96.5 96.5,96.5 3.3,3.3 96.5,3.3
bRestrict: area 26.8,32.4 to 27.6,33.3; area 44.8,32.3 to 46.1,33.5; area 10.2,32.3 to 11.2,33.3; area 12.6,88.6 to 14.7,89.4; area 30.6,88.6 to 32.1,89.4; area 48.6,88.4 to 49.9,89.4; area 66.5,88.5 to 67.8,89.5; area 84.3,88.4 to 85.5,89.3; area 66,60.7 to 98,80.8

### Footprints (pad centres in the part's own frame; a part is rotated, then mirrored left to right if it is on the bottom)
0805 = smd 0.8 x 1.2: 1 -0.9,0; 2 0.9,0
1206@1 = smd 1.6 x 1.8: 1 -1.4,0; 2 1.4,0
EEE-FK1H100UR = smd 1.5 x 2.5: ANODE 0,4; CATHODE 0,0
DO214AA = smd 1.8 x 2.2: A 2.55,0; C -2.55,0
1206 = smd 1.6 x 1.8: 1 -1.4,0; 2 1.4,0
SO08 = smd 0.61 x 2.21: 1 -1.905,-2.616; 2 -0.635,-2.616; 3 0.635,-2.616; 4 1.905,-2.616; 5 1.905,2.616; 6 0.635,2.616; 7 -0.635,2.616; 8 -1.905,2.616
RW_16 = smd 2.299 x 0.559: 1 -4.528,4.445; 2 -4.528,3.175; 3 -4.528,1.905; 4 -4.528,0.635; 5 -4.528,-0.635; 6 -4.528,-1.905; 7 -4.528,-3.175; 8 -4.528,-4.445; 9 4.528,-4.445; 10 4.528,-3.175; 11 4.528,-1.905; 12 4.528,-0.635; 13 4.528,0.635; 14 4.528,1.905; 15 4.528,3.175; 16 4.528,4.445
R-16_ADI = smd 1.46 x 0.559: 1 -2.724,4.445; 2 -2.724,3.175; 3 -2.724,1.905; 4 -2.724,0.635; 5 -2.724,-0.635; 6 -2.724,-1.905; 7 -2.724,-3.175; 8 -2.724,-4.445; 9 2.724,-4.445; 10 2.724,-3.175; 11 2.724,-1.905; 12 2.724,-0.635; 13 2.724,0.635; 14 2.724,1.905; 15 2.724,3.175; 16 2.724,4.445
SO08-2 = smd 0.914 x 1.143: 1 -1.905,-2.731; 2 -0.635,-2.731; 3 0.635,-2.731; 4 1.905,-2.731; 5 1.905,2.731; 6 0.635,2.731; 7 -0.635,2.731; 8 -1.905,2.731
RU_16_ADI = smd 1.473 x 0.356: 1 -2.819,2.275; 2 -2.819,1.625; 3 -2.819,0.975; 4 -2.819,0.325; 5 -2.819,-0.325; 6 -2.819,-0.975; 7 -2.819,-1.625; 8 -2.819,-2.275; 9 2.819,-2.275; 10 2.819,-1.625; 11 2.819,-0.975; 12 2.819,-0.325; 13 2.819,0.325; 14 2.819,0.975; 15 2.819,1.625; 16 2.819,2.275
ISO1H811G = smd 1.5 x 0.305: P$1 0,11.05; P$2 0,10.4; P$3 0,9.75; P$4 0,9.1; P$5 0,8.45; P$6 0,7.8; P$7 0,7.15; P$8 0,6.5; P$9 0,5.85; P$10 0,5.2; P$11 0,4.55; P$12 0,3.9; P$13 0,3.25; P$14 0,2.6; P$15 0,1.95; P$16 0,1.3; P$17 0,0.65; P$18 0,0; P$19 13.2,0; P$20 13.2,0.65; P$21 13.2,1.3; P$22 13.2,1.95; P$23 13.2,2.6; P$24 13.2,3.25; P$25 13.2,3.9; P$26 13.2,4.55; P$27 13.2,5.2; P$28 13.2,5.85; P$29 13.2,6.5; P$30 13.2,7.15; P$31 13.2,7.8; P$32 13.2,8.45; P$33 13.2,9.1; P$34 13.2,9.75; P$35 13.2,10.4; P$36 13.2,11.05 | smd 6.3 x 16.51: VBB 6.65,5.4
MTU1D0505MC = smd 2.54 x 1.016: 0V 6.502,0; +VIN 0,2.54; +VOUT 6.502,2.54; -VIN 0,-2.54; NC 6.502,-2.54
SO16 = smd 0.6 x 1.2: 1 -4.445,-2.8; 2 -3.175,-2.8; 3 -1.905,-2.8; 4 -0.635,-2.8; 5 0.635,-2.8; 6 1.905,-2.8; 7 3.175,-2.8; 8 4.445,-2.8; 9 4.445,2.8; 10 3.175,2.8; 11 1.905,2.8; 12 0.635,2.8; 13 -0.635,2.8; 14 -1.905,2.8; 15 -3.175,2.8; 16 -4.445,2.8
R_8_ADI = smd 1.981 x 0.559: 1 -2.464,1.905; 2 -2.464,0.635; 3 -2.464,-0.635; 4 -2.464,-1.905; 5 2.464,-1.905; 6 2.464,-0.635; 7 2.464,0.635; 8 2.464,1.905
SOT95P237X112-3N = smd 1.25 x 0.65: 1 -1.05,0.95; 2 -1.05,-0.95; 3 1.05,0
UJ_5 = smd 1.321 x 0.559: 1 -1.168,0.95; 2 -1.168,0; 3 -1.168,-0.95; 4 1.168,-0.95; 5 1.168,0.95
POWER_JACK_PTH_LOCK = drill 2.997 pad 4.115: GND 0.025,6.557; GNDBREAK 3.762,10.7 | drill 3.2 pad 4.115: PWR 0,13.878
BNC = drill 1.9 pad 3.2: 3 -5.08,5.08; 4 5.08,5.08 | drill 0.8 long: GND -2.54,0; S 0,0
8POS_MOLEX_SOCKET = drill 1.2 pad 2: P$1 -12,3.5; P$2 -8.5,3.5; P$3 -5,3.5; P$4 -1.5,3.5; P$5 2,3.5; P$6 5.5,3.5; P$7 9,3.5; P$8 12.5,3.5
L3225M = smd 1.6 x 2.2: 1 -1.4,0; 2 1.4,0
RJ45-8 = drill 1 pad 1.88 square: 1 -4.445,6.35 | drill 1 pad 1.88: 2 -3.175,8.89; 3 -1.905,6.35; 4 -0.635,8.89; 5 0.635,6.35; 6 1.905,8.89; 7 3.175,6.35; 8 4.445,8.89 | hole 3.2: -5.715,0; 5.715,0
R0805 = smd 1.1 x 1.4: 1 -1,0; 2 1,0
TEENSY_3.6_DIL = drill 0.965 pad 1.778: 0 -7.62,25.4; 1 -7.62,22.86; 2 -7.62,20.32; 3 -7.62,17.78; 3.3V 7.62,22.86; 3.3V3 -7.62,-7.62; 4 -7.62,15.24; 5 -7.62,12.7; 6 -7.62,10.16; 7 -7.62,7.62; 8 -7.62,5.08; 9 -7.62,2.54; 10 -7.62,0; 11 -7.62,-2.54; 12 -7.62,-5.08; 13 7.62,-5.08; 14/A0 7.62,-2.54; 15/A1 7.62,0; 16/A2 7.62,2.54; 17/A3 7.62,5.08; 18/A4 7.62,7.62; 19/A5 7.62,10.16; 20/A6 7.62,12.7; 21/A7 7.62,15.24; 22/A8 7.62,17.78; 23/A9 7.62,20.32; 24 -7.62,-10.16; 25 -7.62,-12.7; 26 -7.62,-15.24; 27 -7.62,-17.78; 28 -7.62,-20.32; 29 -7.62,-22.86; 30 -7.62,-25.4; 31/A12 -7.62,-27.94; 32/A13 -7.62,-30.48; 33/A14 7.62,-30.48; 34/A15 7.62,-27.94; 35/A16 7.62,-25.4; 36/A17 7.62,-22.86; 37/A18 7.62,-20.32; 38/A19 7.62,-17.78; 39/A20 7.62,-15.24; A21 7.62,-12.7; A22 7.62,-10.16; AGND 7.62,25.4; GND -7.62,27.94; GND1 7.62,-7.62; VIN 7.62,27.94
SQUARE_TRICOLOR_LED = drill 0.8 pad 1.676: P$1 -5.1,5.1; P$2 -5.1,0; P$3 0,0; P$4 0,5.1

### Placement (x,y rotation side)
C1  9.22,25.83 0 top
C2  26.19,25.83 0 top
C3  43.54,25.83 0 top
C4  70.78,55.36 90 top
C5  68.53,70.87 270 top
C6  70.76,70.62 270 top
C7  70.15,8.05 0 top
C8  16.76,16 0 top
C9  52.45,16.13 0 top
C10  34.42,16.26 0 top
C11  75.11,41.78 0 top
C12  54.71,73.51 270 top
C13  16.64,65.96 180 top
C14  5.64,82.3 270 top
C15  68.39,55.33 90 top
C16  71.07,31.29 90 top
C17  81.69,19.76 270 top
C18  76.12,21.21 270 top
C19  72,24.03 90 top
C20  85.37,13.28 270 top
C21  63.07,16.36 0 top
C22  65.18,14.15 180 top
C23  81.08,8.33 270 top
C24  90.25,9.3 90 top
C25  92.46,9.3 270 top
C26  83.62,61.9 180 top
C27  84.35,76.1 90 top
D1  7.59,76.68 180 top
F1  3.17,56.52 0 top
IC1  6.38,21.06 180 top
IC2  23.32,21.06 180 top
IC3  40.64,21.06 180 top
IC4  75.62,63.09 90 top
IC5  65.68,26.01 270 top
IC6  77.85,46.1 90 top
IC7  71.5,12.6 0 top
IC8  27.94,68.45 90 top
IC9  16,31.62 270 top
IC10  32.51,31.62 270 top
IC11  50.8,31.62 270 top
IC12  50.04,77.09 90 top
IC13  85.52,8.64 180 top
IC14  79.5,30.81 270 top
IC15  78.82,19.18 270 top
IC16  82.17,13.69 270 top
J1  -2.69,69.95 270 top
J2  89,22.86 270 top
J3  89,40.89 270 top
J4  89,58.93 270 top
J5  89,76.96 270 top
J6  77.7,0 0 top
L1  17.91,20.57 270 top
L2  35.43,20.7 270 top
L3  53.72,20.7 270 top
L4  84.35,19.94 270 top
MOD1  14.22,3.81 0 top
MOD2  32.07,3.81 0 top
MOD3  49.91,3.81 0 top
PORT1  85.6,96.77 180 top
PORT2  67.75,96.77 180 top
PORT3  49.91,96.77 180 top
PORT4  32.07,96.77 180 top
PORT5  14.22,96.77 180 top
R1  58.93,61.09 90 top
R2  81.92,40.51 0 top
R3  83.06,50.29 0 top
R4  70.24,80.73 90 top
R5  58.88,83.52 0 top
R6  42.82,83.77 270 top
R7  38.61,77.62 90 top
R8  37.2,72.62 180 top
R9  77.34,11.11 180 top
R10  66.08,19.94 270 top
R11  68.19,19.93 270 top
R12  71.2,20.65 0 top
R13  8.92,15.82 180 top
R14  44.48,15.72 180 top
R15  26.62,15.72 0 top
U$1  29.97,45.47 90 top
U$7  [SANWORKS_LOGO]  20.8,56.54 0 top
U$8  50.8,63.37 180 top

### Tracks (layer width: path | path; a pad name or v marks a point on that pad's centre or on a via)
3V3_ISO
  Top 0.508: IC5.16 70.13,22.55 70.16,22.53 71.4,22.53 C19.1
  Top 0.762: IC15.2 77.79,20.3 C18.2 75.45,20.31 74.73,21.03 74.73,21.84 74.74,21.86
  Top 0.813: C19.1 73.47,23.13 74.74,21.86
5V  (via drill 0.65, 0.7, 0.8, 1.1)
  Top 0.508: IC4.1 71.17,56.65 C4.2 68.86,56.26 C15.2
  Top 0.635: v37.29,83.87 37.29,80.82 37.19,80.82 36.58,80.26 36.58,77.42 38.28,76.22 R7.1 R8.1 | PORT1.4 86.26,87.86 86.26,86.65 83.68,84.07 72.67,84.07 70.73,82.13 R4.2 | 64.62,83.9 v64.62,83.98 64.71,83.98 | PORT2.4 68.39,87.67 | 68.15,81.18 v68.15,81.08
  Top 0.762: C15.2 v68.39,58.51 v68.38,58.52
  Top 0.889: R5.2 64.24,83.52 64.62,83.9 | 68.39,87.67 64.71,83.98 | 50.57,87.86 50.57,86.35 49.39,85.17 R6.1 41.85,85.17 40.98,84.3 v40.96,84.32 | PORT4.4 32.7,87.53 36.36,83.87
  Top 1.016: IC9.+VIN v18.54,34.16 | IC10.+VIN 35.05,34.39 v35.04,34.39 | IC11.+VIN v53.34,34.04 | v37.29,83.87 36.36,83.87 | R4.2 69.1,82.13 68.15,81.18 | 50.57,87.86 PORT3.4 | 68.5,56.85 C15.2 68.42,56.76 | v82.04,33.4 IC14.+VIN
  Top 1.778: F1.2 v6.22,56.52
  Route2 0.635: 64.62,80.85 64.59,80.87
  Route2 0.762: v68.38,58.52 67.03,58.52 64.59,56.08
  Route2 0.889: PORT5.4 14.86,80.75 16.1,79.5 32.92,79.5 v37.29,83.87
  Route2 1.143: v40.96,84.32 40.49,83.85 40.47,83.87 v37.29,83.87 39.9,83.87 40.21,83.57
  Route2 1.27: 64.59,56.08 64.59,80.87 | 64.62,80.85 64.62,81.08 | 64.62,81.08 v64.62,83.98 | v68.15,81.08 64.62,81.08 | 40.21,57.02 40.21,83.57
  pour Route2: 1.14,57.78 1.65,30.61 85.46,30.61 85.08,57.78
  pour Route2: 65.02,57.91 68.78,57.91 68.78,58.83 64.91,58.83 65.02,58.5
  cutout Route2: 70.1,58.17 70.1,47.75 80.26,37.59 87.12,37.59 87.12,58.17
5V_ISO  (via drill 0.35, 0.55, 0.65)
  Top 0.381: IC7.3 66.65,13.57 C22.1 | IC7.1 68.01,14.87 67.84,15.04 67.84,15.65 68.02,15.82 v68.01,15.84
  Top 0.508: IC16.4 81.22,11.47 81.23,11.46 v81.22,11.44
  Top 0.559: IC13.2 89.85,8 C24.1
  Top 0.635: C21.2 | C21.2 64.47,16.17 | C22.1 66.02,14.21 66.02,14.86 65.56,15.32 65,15.32 64.47,15.85 C21.2
  Top 0.762: C21.2 v65.94,16.36 | v94.38,7.9 v94.39,7.9 | C24.1 90.27,8.37 91.37,8.37 91.85,7.9 C25.2 | v86.84,12.39 86.83,12.38 C20.2 85.33,12.34 83.3,12.34 IC16.5
  Top 1.016: C25.2 v94.38,7.9
  pour Route2: 90.98,1.6 59.18,1.6 59.18,24.38 60.45,25.65 98.15,25.65 98.15,8.76
  cutout Route2: 87.53,25.93 87.53,22.43 88.09,21.87 90.02,21.87 90.04,21.84 90.53,22.33 90.53,25.86 90.45,25.93
BNCIN1
  Top 0.762: IC6.7 25.4,45.47 19.81,39.88 U$1.6
BNCIN2
  Top 0.762: IC6.6 24.09,46.74 17.27,39.92 U$1.5
BNCOUT1
  Top 0.635: IC4.3 73.71,51.66 71.75,49.71 20.75,49.71 12.19,41.15 U$1.3
BNCOUT2
  Top 0.635: IC4.4 74.98,50.8 72.38,48.2 22.48,48.2 14.73,40.45 U$1.4
BUSY
  Top 0.635: IC5.6 63.78,29.28 63.22,29.84 63.22,30.61
  Top 0.762: U$1.32/A13 62.08,37.85 63.22,36.7 63.22,30.61
CS
  Top 0.635: IC5.4 66.32,29.54 66.23,29.63 66.23,30.94
  Top 0.762: U$1.9 30.53,41.45 63.73,41.45 66.23,38.95 66.23,30.94
GND  (via drill 0.45, 0.5, 0.55, 0.6, 0.65, 0.7)
  Top 0.318: IC8.P$4 18.84,67.67 v19.15,67.11 19.49,67.7 IC8.P$5 | IC8.P$15 25.99,67.16 v26.01,67.06
  Top 0.508: 4.47,25.45 v4.5,25.48 | IC4.2 72.44,55.32 71.58,54.46 C4.1 70.25,53.93 C15.1
  Top 0.635: IC2.4 v21.41,25.5 | 4.47,25.45 IC1.4 | IC3.4 v38.73,25.48 | C12.1 54.73,74.42 v56.11,74.42 | IC12.8 v54.1,81.53 | IC4.5 76.25,56.53 v76.24,56.53 | C1.2 v10.12,24.29 v10.12,24.3 | C2.2 27.09,24.3 v27.1,24.28 | C3.2 v44.44,24.34 v44.44,24.35 | IC5.8 v61.24,30.89
  Top 0.762: IC6.5 v73.66,48.01 | v71.02,33.4 71.07,33.35 C16.2 | C13.2 v14.55,65.96
  Top 1.016: C11.2 77.32,41.78 v77.34,41.81 | IC9.-VIN 13.46,32.77 v10.67,32.77 | IC10.-VIN 29.97,32.77 v27.18,32.77 | IC11.-VIN 48.26,32.77 45.47,32.77 v45.47,32.85 | R1.1 v58.93,57.91 | C15.1 v68.39,52.2 | IC14.-VIN 76.96,33.5 v76.94,33.5
  other vias: 81.28,58.42 81.28,57.4 81.28,56.39 80.26,56.39
  pour Route15: 1.27,57.18 1.27,30.48 45.97,30.35 45.97,57.05
  pour Top: 80.01,58.67 80.01,55.63 81.79,55.63 81.79,58.67
  pour Bottom: 93.14,95 6.27,95 1.19,89.92 1.19,9.7 9.3,1.6 57.91,1.6 57.91,25.12 59.72,26.92 98.2,26.92 98.2,89.94
GND_ISO  (via drill 0.45, 0.5, 0.6)
  Top 0.508: 68.7,72.44 C5.1 | C6.1 71.6,71.53 72.47,70.66 72.47,67.65 IC4.15
  Top 0.635: v66.95,72.29 66.98,72.27 | C6.1 69.62,71.53 68.7,72.44 | C27.1 v84.35,73.86 | C26.2 82.72,63.05 82.35,63.42 v82.32,63.42
  Top 0.762: C5.1 66.98,72.27
  other vias: 80.26,69.6 81.28,67.56 81.28,68.58 81.28,69.6
  pour Route15: 66.55,74.78 66.55,67.46 72.8,61.21 97.49,61.21 97.49,80.01 71.78,80.01
  pour Top: 80.01,70.1 80.01,67.31 81.79,67.31 81.79,70.1
  cutout Route15: 90.42,77.98 87.63,77.98 87.63,75.95 90.42,75.95
GND_ISO2  (via drill 0.35, 0.5, 0.55, 0.65)
  Top 0.381: v72.11,8.05 C7.2 | v76.15,13.82 75.91,13.57 IC7.14
  Top 0.508: IC13.4 89.17,10.54 89.51,10.2 C24.2 | C23.2 81.08,6.25 v81.06,6.24 | IC5.9 61.24,21.92 v61.21,21.92 | IC16.2 v82.17,16.13
  Top 0.635: C22.2 v63.12,14.15
  Top 0.762: v73.28,24.92 72.01,24.92 C19.2 | 81.67,20.65 C17.1 81.69,22.12 v81.66,22.12 | 81.67,20.65 81.61,20.65 | C24.2 91.32,10.2 91.85,10.72 92.48,10.72 | C21.1 61.26,15.95 v61.26,14.63 v61.27,14.63 | v86.82,14.2 85.38,14.2 C20.1 | C18.1 77.71,22.11 77.72,22.1 v77.74,22.11 | IC15.1 79.77,20.28 80.16,20.68 81.65,20.68 81.67,20.65
  Top 1.016: C25.1 92.48,10.72 94.31,10.72 94.32,10.73 v94.35,10.73 | IC14.0V v79.5,22.12
  pour Bottom: 59.16,24.38 60.45,25.68 97.97,25.68 97.97,8.74 90.81,1.57 59.16,1.57
GNDBB  (via drill 0.6, 1)
  Top 0.305: 28.04,82.47 27.94,82.37 IC8.P$19
  Top 0.508: v28.88,82.47 28.04,82.47
  Top 1.524: C14.CATHODE v3.25,82.3 | D1.A 3.23,76.68 v3.2,76.66
  Route15 0.508: v28.88,82.47 28.73,82.47 28.73,83.03
  Route15 1.524: v3.25,82.3 3.3,81.48 | v3.2,76.66 3.2,76.76 3.25,76.81
  pour Route15: 82.89,87.19 82.89,93.95 5.87,93.95 2.54,90.63 2.54,62.99 11.68,62.99 11.58,80.52 29.11,80.52 29.23,87.14
IO7  (via drill 0.35)
  Top 0.381: IC7.13 74.33,12.94 76.49,12.94 76.95,13.4 76.95,15.87 v73.79,19.02 | IC5.11 63.78,22.52 63.14,21.89 63.14,20.52 v64.59,19.07
  Route15 0.508: v64.59,19.07 73.74,19.07 v73.79,19.02
LED_BLUE
  Route15 1.016: U$8.P$3 53.17,61 53.17,57.45 54.7,55.93 58.62,55.93 60.45,54.1 U$1.33/A14
LED_GREEN
  Bottom 1.016: U$8.P$1 55.86,58.27 55.38,57.8 55.38,53.1 U$1.35/A16
LED_RED
  Top 0.635: U$8.P$4 50.8,56.86 51.8,55.85 61.57,55.85 62.82,54.6 62.82,52.24 61.59,51.02 19.11,51.03 9.65,41.57 U$1.2
MISO
  Top 0.635: IC5.5 65.05,29.41 64.72,29.74 64.72,30.58
  Top 0.762: U$1.12 35.05,38.3 36.63,39.88 63.25,39.88 64.72,38.41 64.72,30.58
MOSI  (via drill 0.6)
  Top 0.635: IC5.2 68.86,29.46 69.27,29.87 69.27,30.5 69.25,30.52 | v26.77,39.93 26.87,39.93
  Top 0.762: 69.25,30.52 69.25,40.33 65.41,44.17 31.11,44.17 26.87,39.93
  Bottom 0.762: U$1.11 32.51,38.12 30.73,39.9 26.8,39.9 v26.77,39.93
N$1
  Top 0.635: MOD3.4 49.28,13.21 47.37,15.11 46.61,15.11 R14.1 45.88,16.38 44.68,17.58 42.55,17.58 IC3.8
N$2  (via drill 0.6)
  Top 0.635: v43.03,13.87 43.08,13.92 R14.2 42.72,15.82 41.27,17.27 IC3.7
  Bottom 0.635: v43.03,13.87 43.05,13.84 43.05,8.76 43.97,7.85 46.74,7.85 47.9,9.02 47.9,10.06 MOD3.3
N$3
  Top 0.635: IC3.6 40.01,16.71 41.38,15.34 41.38,13.56 42.24,12.7 MOD3.2
N$4
  Top 0.635: IC3.5 38.73,16.13 40.18,14.68 40.18,11.94 41.96,10.16 MOD3.1
N$5
  Top 0.635: U$1.25 42.67,37.08 41.27,35.69 IC3.2
N$6
  Top 0.635: U$1.24 40.01,37.47 IC3.3
N$7
  Top 0.635: MOD1.4 13.08,13.21 13.08,13.41 10.67,15.82 R13.1 10.31,16.36 9.02,17.65 8.28,17.65 IC1.8
N$8  (via drill 0.6)
  Top 0.635: v7.54,14.1 7.54,15.8 R13.2 7.01,16.33 IC1.7
  Bottom 0.635: v7.54,14.1 7.54,8.71 8.38,7.87 11.25,7.87 12.45,9.66 12.45,10.03 MOD1.3
N$9
  Top 0.635: IC1.6 5.74,13.89 6.93,12.7 MOD1.2
N$10
  Top 0.635: IC1.5 4.47,12.42 6.73,10.16 MOD1.1
N$11  (via drill 0.6)
  Top 0.635: IC1.2 7.01,35.61 v7.04,35.61
  Bottom 0.635: v7.04,35.61 6.07,35.61 4.57,37.11 U$1.0
N$12
  Top 0.635: IC1.3 5.74,36.47 U$1.1
N$13
  Top 0.762: IC6.3 85.7,46.74 J3.GND
N$14
  Top 0.762: R3.2 85.85,50.29 91.69,44.45 91.69,42.16 90.42,40.89 J3.S
N$15
  Top 0.762: R2.2 84.58,39.25 84.58,25.91 87.63,22.86 J2.S
N$16
  Top 0.762: IC6.2 82.8,45.47 86.11,42.16 86.11,28.19 88.9,25.4 J2.GND
N$17
  Top 0.635: 28.38,15.72 R15.2 | MOD2.4 31.27,12.87 31.27,13.16 29.29,15.14 28.55,15.14 28.03,15.66 R15.2 | IC2.8 25.22,17.63 26.59,17.63 28.03,16.19 R15.2
N$18  (via drill 0.6)
  Top 0.635: v25.38,13.95 25.38,15.47 25.22,15.62 R15.1 23.95,16.99 IC2.7
  Bottom 0.635: v25.38,13.95 25.35,13.92 25.35,8.94 26.51,7.87 28.94,7.87 30.15,9.49 30.15,10.15 MOD2.3
N$19
  Top 0.635: 28.87,12.72 MOD2.2 24.21,12.7 23.39,13.51 23.39,15.57 22.68,16.28 IC2.6
N$20
  Top 0.635: 58.12,81.58 56.79,80.26 IC12.7 | 58.12,81.58 64.39,81.58 69.03,86.22 72.05,86.22 73.22,87.39 73.22,89.41 PORT2.1 | R5.1 57.48,82.22 58.12,81.58
N$21
  Top 0.635: IC2.5 21.41,15.85 22.25,15.01 22.25,11.96 24.05,10.16 MOD2.1
N$22
  Top 0.635: IC2.2 23.95,35.03 22.45,36.52 22.35,36.58 U$1.7
N$23
  Top 0.762: 18.8,16 C8.2
  Top 0.813: C8.2 17.66,18.93
  Top 0.889: 17.66,18.93 L1.2
  Top 1.016: MOD1.5 14.73,10.03 14.73,9.02 16.13,7.62 18.41,7.62 20.68,9.88 20.68,14.12 18.8,16
N$24
  Top 0.635: IC12.9 46.75,81.53 | R6.2 43.66,81.53 46.75,81.53 | PORT3.1 54.91,90.42 56.12,89.22 56.12,85.98 53.63,83.49 47.68,83.49 46.75,82.56 46.75,81.53
N$25
  Top 1.016: U$8.P$2 56.28,63.75 58.93,63.75 R1.2
N$26
  Top 0.813: 15.86,12.96 C8.1 15.88,16.01 15.88,16.82 15.62,17.07 15.62,17.27
  Top 0.889: 15.86,12.96 MOD1.6
  Top 1.016: IC9.0V 16,23.67 15.62,23.29 15.62,17.27
N$27  (via drill 0.5, 0.6)
  Top 0.508: IC4.16 71.17,68.78 70.74,69.22 70.74,69.7 C6.2
  Top 0.635: IC4.11 77.52,69.8 v77.47,69.85 | C6.2 68.79,69.72 C5.2
  Top 0.762: C5.2 68.48,69.42 v68.48,67.79
  Bottom 0.635: v77.47,69.85 70.54,69.85 v68.48,67.79
N$28  (via drill 0.6)
  Top 0.635: IC2.3 22.68,23.95 22.55,24.18 22.55,34.27 v22.3,34.52
  Bottom 0.635: v22.3,34.52 24.92,37.13 24.92,37.77 24.89,37.8 U$1.8
N$29
  Top 1.524: U$1.VIN 1.83,53.26 F1.1
N$30
  Top 0.381: IC7.4 64.59,12.92 63.08,11.42 63.08,6.16 63.07,6.13 J6.P$1
N$31
  Top 0.635: IC12.11 39.67,78.99 | 39.67,78.99 38.99,78.99 R7.2 | PORT4.1 38.29,90.42 39.67,89.04 39.67,78.99
N$32
  Top 0.635: IC4.14 73.71,70.83 79.88,77 C27.2 84.39,76.96 J5.S
N$33
  Top 0.635: IC4.13 74.98,69.79 77.61,72.42 81.79,72.42 84.53,69.67 84.52,69.66 C26.1 84.48,61.86 84.48,61.32 86.87,58.93 J4.S
N$34
  Top 0.381: J6.P$3 71.15,5.05 66.37,5.05 64.27,7.16 64.27,10.88 65.66,12.27 IC7.5
N$35
  Top 0.381: IC7.6 66.33,11.62 65.46,10.74 65.46,7.43 67.1,5.79 77.41,5.79 J6.P$5
N$36
  Top 0.381: IC7.7 67.41,10.97 66.65,10.21 66.65,7.62 67.72,6.55 78.54,6.55 79.88,5.21 84.99,5.21 J6.P$7
N$37
  Top 0.762: IC14.+VOUT 82.04,23.85
  Top 1.016: L4.1 84.35,21.54 82.04,23.85
N$38
  Top 0.508: IC5.15 68.86,22.45 70.2,21.12 R12.1
N$39
  Top 1.016: IC9.+VOUT 18.54,22.61 L1.1
N$40
  Top 0.508: IC5.14 67.59,21.52 R11.1
N$41  (via drill 0.65)
  Top 0.635: IC12.14 45.85,75.18 45.83,75.17 v45.71,75.17 | v36.82,74.47 36.02,74.47 35.79,74.24 R8.2 35.59,72.62 34.1,74.11 34.1,81.42 33.12,82.4 v33.12,84.31 | v21.41,89.41 19.67,89.41 PORT5.1
  Bottom 0.635: v36.82,74.47 36.85,74.47 36.87,74.49 45.03,74.49 v45.71,75.17 | v21.41,89.41 21.43,89.38 23.32,89.38 26.92,85.78 32.55,85.78 33.13,85.19 33.13,84.31 v33.12,84.31
N$42
  Top 0.508: IC5.13 66.32,21.18 R10.1
N$43
  Top 0.813: 32.51,17.4 32.51,17.26 C10.1 33.52,13.15 MOD2.6
  Top 1.016: 32.51,17.4 IC10.0V
N$44
  Top 0.813: L2.2 35.32,19.18 C10.2 35.34,16.28 36.37,16.28
  Top 1.016: MOD2.5 32.64,8.51 33.4,7.75 36.83,7.75 38.63,9.55 38.63,14.02 36.37,16.28
N$45
  Top 1.016: L2.1 35.05,22.1 IC10.+VOUT
N$46  (via drill 0.35)
  Top 0.381: v64.59,20.45 64.59,21.97 65.08,22.45 65.08,23.26 IC5.12 | R9.1 78.34,11.52 77.68,12.18 77.68,16.53 v73.81,20.4
  Route15 0.508: v64.59,20.45 73.76,20.45 v73.81,20.4
N$47
  Top 0.813: 50.8,17.29 50.8,16.88 C9.1 51.55,12.96 MOD3.6
  Top 1.016: 50.8,17.29 IC11.0V
N$49
  Top 0.813: L3.2 53.35,18.93 C9.2 53.38,16.15 53.95,16.15
  Top 1.016: MOD3.5 50.42,8.76 51.18,8 54.61,8 56.52,9.91 56.52,13.59 53.95,16.15
N$50
  Top 1.016: IC11.+VOUT 53.34,22.1 L3.1
N$54
  Top 0.762: IC6.1 80.58,40.58 R2.1
N$55
  Top 0.762: IC6.4 81.79,48.01 81.79,50.16 R3.1
N$56
  Top 0.635: IC12.5 68.78,77.72 70.24,79.18 R4.1 70.28,79.3 70.79,79.3 74.35,82.86 86.74,82.86 90.77,86.88 90.77,89.7 PORT1.1
PORT1IN
  Top 0.635: IC12.4 58.42,76.45 60.31,74.55 60.3,71.69 56.52,67.94 48.64,67.94 45.21,64.52 U$1.39/A20
PORT1LED
  Top 0.635: PORT1.3 87.49,90.44 87.49,91.55 88.53,92.6 91.38,92.6 92.2,91.77 92.2,86.72 87.15,81.66 76.22,81.66 69.75,75.18 67.56,75.18 58.04,65.66 50.42,65.66 49.06,64.3 49.06,56.86 U$1.36/A17
PORT2IN  (via drill 0.6)
  Top 0.635: IC12.6 v61.98,78.99 | v61.98,76.2 61.85,71.37 57.28,66.8 49.4,66.8 46.61,64.01 46.61,54.91 47.75,53.77 U$1.38/A19
  Route2 0.635: v61.98,78.99 v61.98,76.2
PORT2LED  (via drill 0.55, 0.6)
  Top 0.635: PORT2.3 69.61,90.47 69.61,91.73 70.59,92.71 73.72,92.71 74.59,91.85 74.59,87.06 72.63,85.1 69.58,85.1 64.62,80.14 v58.8,80.14 | U$1.37/A18 50.29,53.62 47.78,56.13 v47.78,59.24
  Route2 0.635: v47.78,59.24 47.82,59.28 47.82,68.06 49.1,69.34 56.07,69.34 58.8,72.07 v58.8,80.14
PORT3IN  (via drill 0.6)
  Top 0.635: v41.74,80.24 41.74,80.26 IC12.10 | v41.73,77.56 41.73,71.01 24.89,54.17 U$1.17/A3
  Route2 0.635: v41.73,77.56 41.73,80.23 v41.74,80.24
PORT3LED  (via drill 0.6)
  Top 0.635: v44.22,76.25 44.22,69.81 29.97,55.56 U$1.15/A1
  Route2 0.635: v44.22,76.25 44.22,81.69 46.97,84.43 53.24,84.43 57.2,88.39 57.2,91.3 55.65,92.85 53.24,92.85 51.82,91.43 PORT3.3
PORT4IN
  Top 0.635: U$1.16/A2 27.43,54.85 42.9,70.31 42.9,76.95 43.68,77.73 IC12.12
PORT4LED  (via drill 0.55)
  Top 0.635: v37.18,60.93 37.24,60.87 32.51,56.15 U$1.14/A0
  Route2 0.635: v38.62,87.64 38.62,92.11 37.96,92.77 34.9,92.77 33.97,91.85 PORT4.3
  Route15 0.635: v37.18,60.93 37.18,60.95 33.2,64.94 33.2,82.25 38.61,87.66 v38.62,87.64
PORT5IN
  Top 0.635: IC12.15 46.55,73.91 45.81,73.18 45.81,69.29 40.13,63.61 U$1.A22
PORT5LED  (via drill 0.65)
  Top 0.635: v31.33,84.39 31.33,82.14 32.08,81.39 32.08,63.28 22.35,53.56 U$1.18/A4 | PORT5.3 16.13,91.47 17.58,92.91 20.56,92.91 22.9,90.58 v22.9,87.5
  Bottom 0.635: v31.33,84.39 31.27,84.39 31.14,84.52 25.89,84.52 22.91,87.5 v22.9,87.5
POUR_A
  cutout Route15: 11.82,89.38 11.82,88.37 10.33,88.37 10.33,89.37 10.34,89.38
POUR_B
  cutout Route15: 28.19,89.48 28.19,88.28 29.58,88.28 29.58,89.41 29.5,89.48
POUR_C
  cutout Route15: 45.97,89.62 45.97,88.4 47.46,88.4 47.46,89.52 47.36,89.62
POUR_D
  cutout Route15: 63.86,89.66 63.86,88.33 63.84,88.32 65.24,88.32 65.24,89.62 65.2,89.66
POUR_E
  cutout Route15: 81.66,89.66 81.66,88.37 83.07,88.37 83.08,88.35 83.08,89.61 83.03,89.66
REF2V5
  Top 0.381: IC7.8 68.01,10.32 67.72,10.03 67.72,8.42 68.09,8.05 C7.1
  Top 0.508: 80.48,9.23 C23.1
  Top 0.635: IC13.6 81.12,9.27 C23.1 | 80.48,9.23 79.51,8.27 74,8.27 72.92,9.35 69.57,9.35 69.15,8.93 69.15,8.15 C7.1
SCK  (via drill 0.6)
  Top 0.635: IC5.3 67.59,29.59 67.77,29.77 67.77,30.49
  Top 0.762: v34.47,42.88 64.47,42.88 67.77,39.57 67.77,30.49
  Bottom 0.762: U$1.13 34.47,53.01 v34.47,42.88
SCLK
  Top 0.381: IC7.16 75.01,14.87 75.01,15.37 73.74,16.64 70.13,16.64 68.19,18.58 R11.2
SDI
  Top 0.381: IC7.15 75.44,14.22 75.79,14.58 75.79,15.71 72.2,19.3 R12.2
SDO
  Top 0.381: IC7.9 75.55,10.32 R9.2
SYNC
  Top 0.381: IC7.2 67.69,14.22 67.02,14.9 67.02,17.9 66.08,18.84 R10.2
V_ISO2
  Top 0.508: 81.67,16.96 81.68,16.96 | 82.09,17.22 82.12,17.25 | 82.12,18.45 C17.2 | 82.41,17.22 82.09,17.22 | 82.09,17.22 81.94,17.22
  Top 0.559: 81.68,16.96 81.94,17.22 | IC16.3 81.22,16.51 81.67,16.96 | IC16.1 83.12,16.51 82.41,17.22
  Top 0.762: L4.2 84.02,18.87 C17.2 81.67,18.87 80.9,18.87 80.15,18.13 IC15.3 | 82.12,17.25 82.12,18.45
VBB
  Top 1.524: IC8.VBB 17.1,75.1 | J1.PWR 10.14,71.1 10.14,76.79 D1.C 10.14,79.14 9.4,79.88 9.4,82.06 C14.ANODE 11.94,82.3 13.46,80.77 13.46,78.99 17.35,75.1 IC8.VBB | IC8.VBB 19.39,75.1 | IC8.VBB 17.86,75.1
VCC  (via drill 0.55, 0.6, 0.65, 0.8)  (1 unrouted)
  Top 0.305: 18.16,67.49 18.19,67.52 IC8.P$3
  Top 0.318: IC8.P$2 17.54,67.49
  Top 0.406: 18.16,67.49 17.54,67.49
  Top 0.508: 17.54,67.49 C13.1
  Top 0.635: IC1.1 8.28,25.79 C1.1 8.32,27.27 v8.29,27.29 | IC2.1 25.22,25.38 C2.1 25.3,25.84 v25.3,27.3 | IC3.1 42.55,25.26 C3.1 42.57,25.41 v42.57,27.2 | IC12.1 54.67,72.64 C12.2 | IC5.1 70.13,29.48 71.05,30.39 C16.1 71.26,30.39 72.31,29.34 v72.31,29.03
  Top 0.762: v47.12,70.87 54.49,70.87 54.71,71.09 C12.2 | C11.1 | C13.1 17.54,64.32 v17.09,63.88
  Top 0.889: C11.1 74.22,44.2 IC6.8 | C11.1 74.21,40.34 74.19,40.32 74.19,28.34 v74.3,28.23
  Top 1.016: v38.09,28.64 38.12,28.68 38.12,32.75 37.58,33.3 U$1.3.3V3
  Top 1.27: U$1.3.3V 7.11,54.08 17.09,63.87 v17.09,63.88
  Route2 0.762: v74.3,28.23 74.55,28.23
  Route2 1.27: v17.09,63.88 31.37,63.83 v38.2,70.36
  Bottom 1.016: v38.2,70.36 46.61,70.36 v47.12,70.87
  pour Route2: 1.4,29.46 1.27,20.34 56.44,20.1 57.8,21.44 57.83,25.27 59.6,27.04 75.76,27.08 75.76,29.36
VLV1IN
  Top 0.305: IC8.P$12 24.04,67.58 23.85,67.39 23.85,66.88
  Top 0.635: 23.85,66.88 23.85,61.95 17.27,55.37 U$1.20/A6
VLV1OUT
  Top 0.305: IC8.P$24 24.69,82.53 24.98,82.82 25.01,82.79 | IC8.P$23 25.34,82.58 25.01,82.92
  Top 0.889: PORT1.6 83.69,86.73 82.6,85.64 78.13,85.64 76.67,87.1 76.67,91.96 74.64,93.99 26.38,93.99 24.31,91.92 24.31,85.22 25.02,84.51
  Top 1.016: 25.02,84.51 25.01,84.49 25.01,82.92 25.01,82.79
VLV2IN
  Top 0.305: IC8.P$13 24.69,67.56 24.84,67.41 24.84,66.8
  Top 0.635: 24.84,66.8 24.84,60.76 19.81,55.73 U$1.19/A5
VLV2OUT
  Top 0.305: IC8.P$22 25.99,82.47 26.31,82.79 26.64,82.47 IC8.P$21
  Top 0.889: PORT2.6 65.85,87.63 63.96,85.74 60.54,85.74 58.69,87.59 58.69,91.15 57.23,92.61 27.56,92.61 25.74,90.79 25.74,86.28 26.31,85.71 26.31,82.79
VLV3IN
  Top 0.305: 22.74,67.09 IC8.P$10
  Top 0.635: 22.74,67.09 22.74,63.1 14.73,55.09 U$1.21/A7
VLV3OUT  (via drill 0.55)
  Top 0.305: IC8.P$27 22.74,82.45 22.42,82.78 22.09,82.45 IC8.P$28
  Top 0.889: 22.42,82.78 22.42,84.73 v22.4,84.72
  Route2 0.889: PORT3.6 48.01,87.26 46.47,85.72 30.23,85.72 28.89,84.39 22.73,84.39 v22.4,84.72
VLV4IN
  Top 0.305: 21.44,67.11 21.44,67.1 IC8.P$8
  Top 0.635: 21.44,67.11 21.44,63.75 12.19,54.51 U$1.22/A8
VLV4OUT  (via drill 0.65)
  Top 0.305: IC8.P$32 19.49,82.42 19.84,82.77 | IC8.P$31 20.14,82.64 19.84,82.94
  Top 1.016: v19.84,86.03 19.84,82.94 19.84,82.77
  Route2 0.889: PORT4.6 30.16,87.8 28.43,86.07 19.81,86.07 19.81,86.06 v19.84,86.03
VLV5IN
  Top 0.254: 20.14,67.5
  Top 0.305: 20.27,67.03 20.15,67.16 20.15,67.49 20.14,67.5 | 20.14,67.5 IC8.P$6
  Top 0.635: 20.27,67.03 20.27,64.66 9.65,54.04 U$1.23/A9
VLV5OUT
  Top 0.305: IC8.P$36 16.89,82.35 17.2,82.65 17.2,82.8 17.21,82.79 | 17.21,82.79 17.21,82.69 17.54,82.36 IC8.P$35 | 17.25,82.68 17.25,82.75 17.21,82.79
  Top 0.889: PORT5.6 12.32,86.3 14.19,84.43 15.49,84.43 17.25,82.68

### Text on the board
tPlace: 10uf | + | Out 2 | + | IC8 | . | Pos. Ctr | 12-24VDC | Out 1 | Teensy 4.1 | In 2 | Bpod FSM 2+ | 9V | 9V | 9V | 9V | In 1 | * | IC16 | rev1.3 | J6